# EAGLE schematic Main_Board (EAGLE 9.2.1)

## Sheet 1 of 9: Sync generation circuit
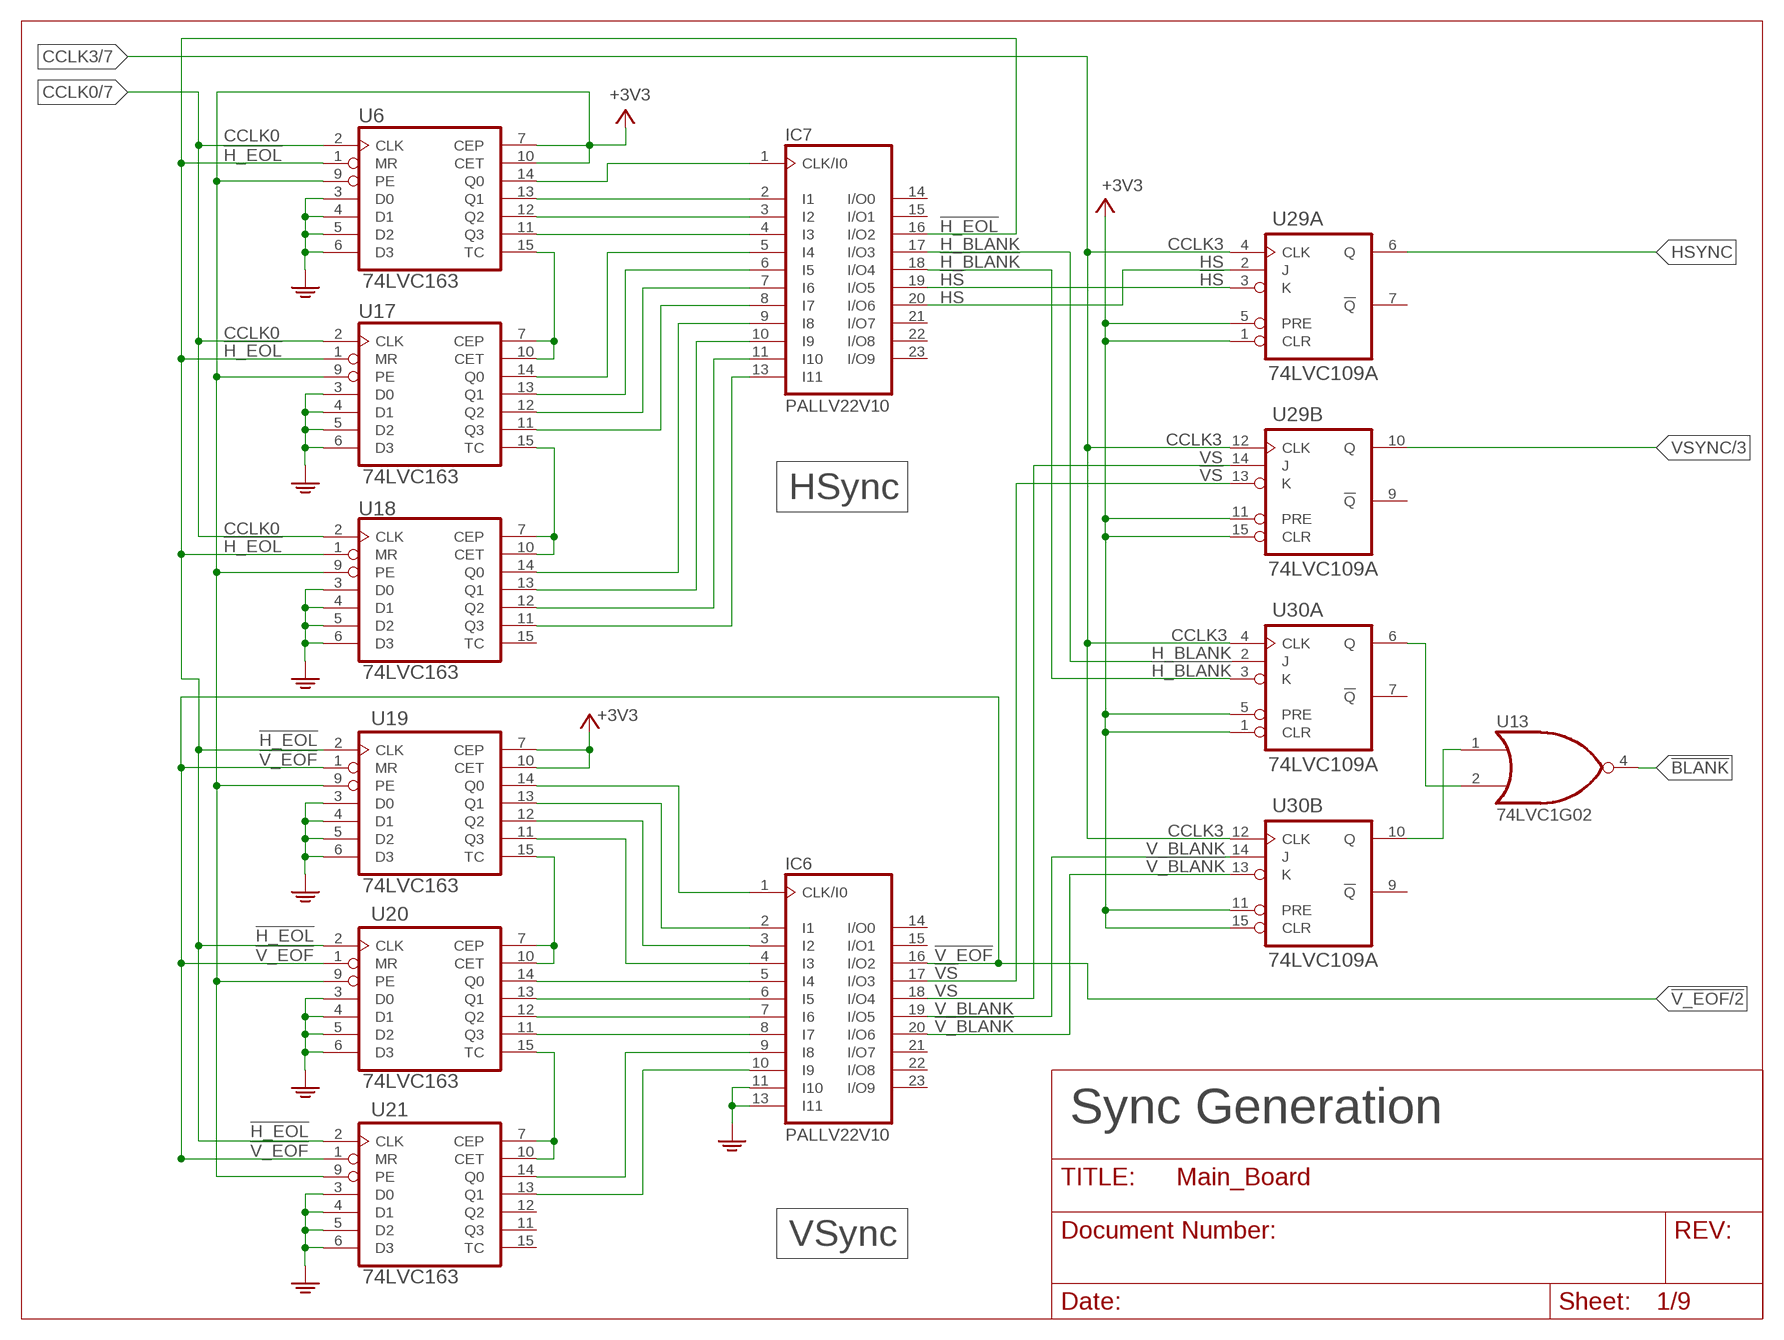
[diagram p0: schematic, sheet 1]

### Parts
IC6  PALLV22V10  [DIP24]
IC7  PALLV22V10  [DIP24]
U6  74LVC163  [SO16D(SOT109)]
U13  74LVC1G02  [SC70-5(SOT353)]
U17  74LVC163  [SO16D(SOT109)]
U18  74LVC163  [SO16D(SOT109)]
U19  74LVC163  [SO16D(SOT109)]
U20  74LVC163  [SO16D(SOT109)]
U21  74LVC163  [SO16D(SOT109)]
U29  74LVC109A  [SO16D(SOT109)]
U30  74LVC109A  [SO16D(SOT109)]

### Nets
!BLANK: U13.4(Y) ; also sheet 6
!H_BLANK: IC7.18(I/O4) U30.3(A:K)
!H_EOL: IC7.16(I/O2) U6.1(MR) U17.1(MR) U18.1(MR) U19.2(CLK) U20.2(CLK) U21.2(CLK)
!HS: IC7.19(I/O5) U29.3(A:K)
!V_BLANK: IC6.20(I/O6) U30.13(B:K)
!V_EOF: IC6.16(I/O2) U19.1(MR) U20.1(MR) U21.1(MR) ; also sheet 2
!VS: IC6.17(I/O3) U29.13(B:K)
+3V3: U6.7(CEP) U6.9(PE) U6.10(CET) U17.9(PE) U18.9(PE) U19.7(CEP) U19.9(PE) U19.10(CET) U20.9(PE) U21.9(PE) U29.1(A:CLR) U29.5(A:PRE) U29.11(B:PRE) U29.15(B:CLR) U30.1(A:CLR) U30.5(A:PRE) U30.11(B:PRE) U30.15(B:CLR) ; also sheet 2,3,4,5,7,8,9
CCLK0: U6.2(CLK) U17.2(CLK) U18.2(CLK) ; also sheet 7
CCLK3: U29.4(A:CLK) U29.12(B:CLK) U30.4(A:CLK) U30.12(B:CLK) ; also sheet 7
GND: IC6.11(I10) IC6.13(I11) U6.3(D0) U6.4(D1) U6.5(D2) U6.6(D3) U17.3(D0) U17.4(D1) U17.5(D2) U17.6(D3) U18.3(D0) U18.4(D1) U18.5(D2) U18.6(D3) U19.3(D0) U19.4(D1) U19.5(D2) U19.6(D3) U20.3(D0) U20.4(D1) U20.5(D2) U20.6(D3) U21.3(D0) U21.4(D1) U21.5(D2) U21.6(D3) ; also sheet 2,3,4,5,6,7,8
H_BLANK: IC7.17(I/O3) U30.2(A:J)
H_Q0: IC7.1(CLK/I0) U6.14(Q0)
H_Q1: IC7.2(I1) U6.13(Q1)
H_Q2: IC7.3(I2) U6.12(Q2)
H_Q3: IC7.4(I3) U6.11(Q3)
H_Q4: IC7.5(I4) U17.14(Q0)
H_Q5: IC7.6(I5) U17.13(Q1)
H_Q6: IC7.7(I6) U17.12(Q2)
H_Q7: IC7.8(I7) U17.11(Q3)
H_Q8: IC7.9(I8) U18.14(Q0)
H_Q9: IC7.10(I9) U18.13(Q1)
H_Q10: IC7.11(I10) U18.12(Q2)
H_Q11: IC7.13(I11) U18.11(Q3)
HB_L: U13.2(B) U30.6(A:Q)
HS: IC7.20(I/O6) U29.2(A:J)
HSYNC: U29.6(A:Q) ; also sheet 6
N$26: U6.15(TC) U17.7(CEP) U17.10(CET)
N$27: U17.15(TC) U18.7(CEP) U18.10(CET)
N$44: U19.15(TC) U20.7(CEP) U20.10(CET)
N$45: U20.15(TC) U21.7(CEP) U21.10(CET)
V_BLANK: IC6.19(I/O5) U30.14(B:J)
V_Q0: IC6.1(CLK/I0) U19.14(Q0)
V_Q1: IC6.2(I1) U19.13(Q1)
V_Q2: IC6.3(I2) U19.12(Q2)
V_Q3: IC6.4(I3) U19.11(Q3)
V_Q4: IC6.5(I4) U20.14(Q0)
V_Q5: IC6.6(I5) U20.13(Q1)
V_Q6: IC6.7(I6) U20.12(Q2)
V_Q7: IC6.8(I7) U20.11(Q3)
V_Q8: IC6.9(I8) U21.14(Q0)
V_Q9: IC6.10(I9) U21.13(Q1)
VB_L: U13.1(A) U30.10(B:Q)
VS: IC6.18(I/O4) U29.14(B:J)
VSYNC: U29.10(B:Q) ; also sheet 3,6
Unconnected: IC6.14(I/O0) IC6.15(I/O1) IC6.21(I/O7) IC6.22(I/O8) IC6.23(I/O9) IC7.14(I/O0) IC7.15(I/O1) IC7.21(I/O7) IC7.22(I/O8) IC7.23(I/O9) U18.15(TC) U21.11(Q3) U21.12(Q2) U21.15(TC) U29.7(A:!Q) U29.9(B:!Q) U30.7(A:!Q) U30.9(B:!Q)

### Notes on the sheet
- HSync
- Sync Generation
- VSync

## Sheet 2 of 9: Pixel address counter
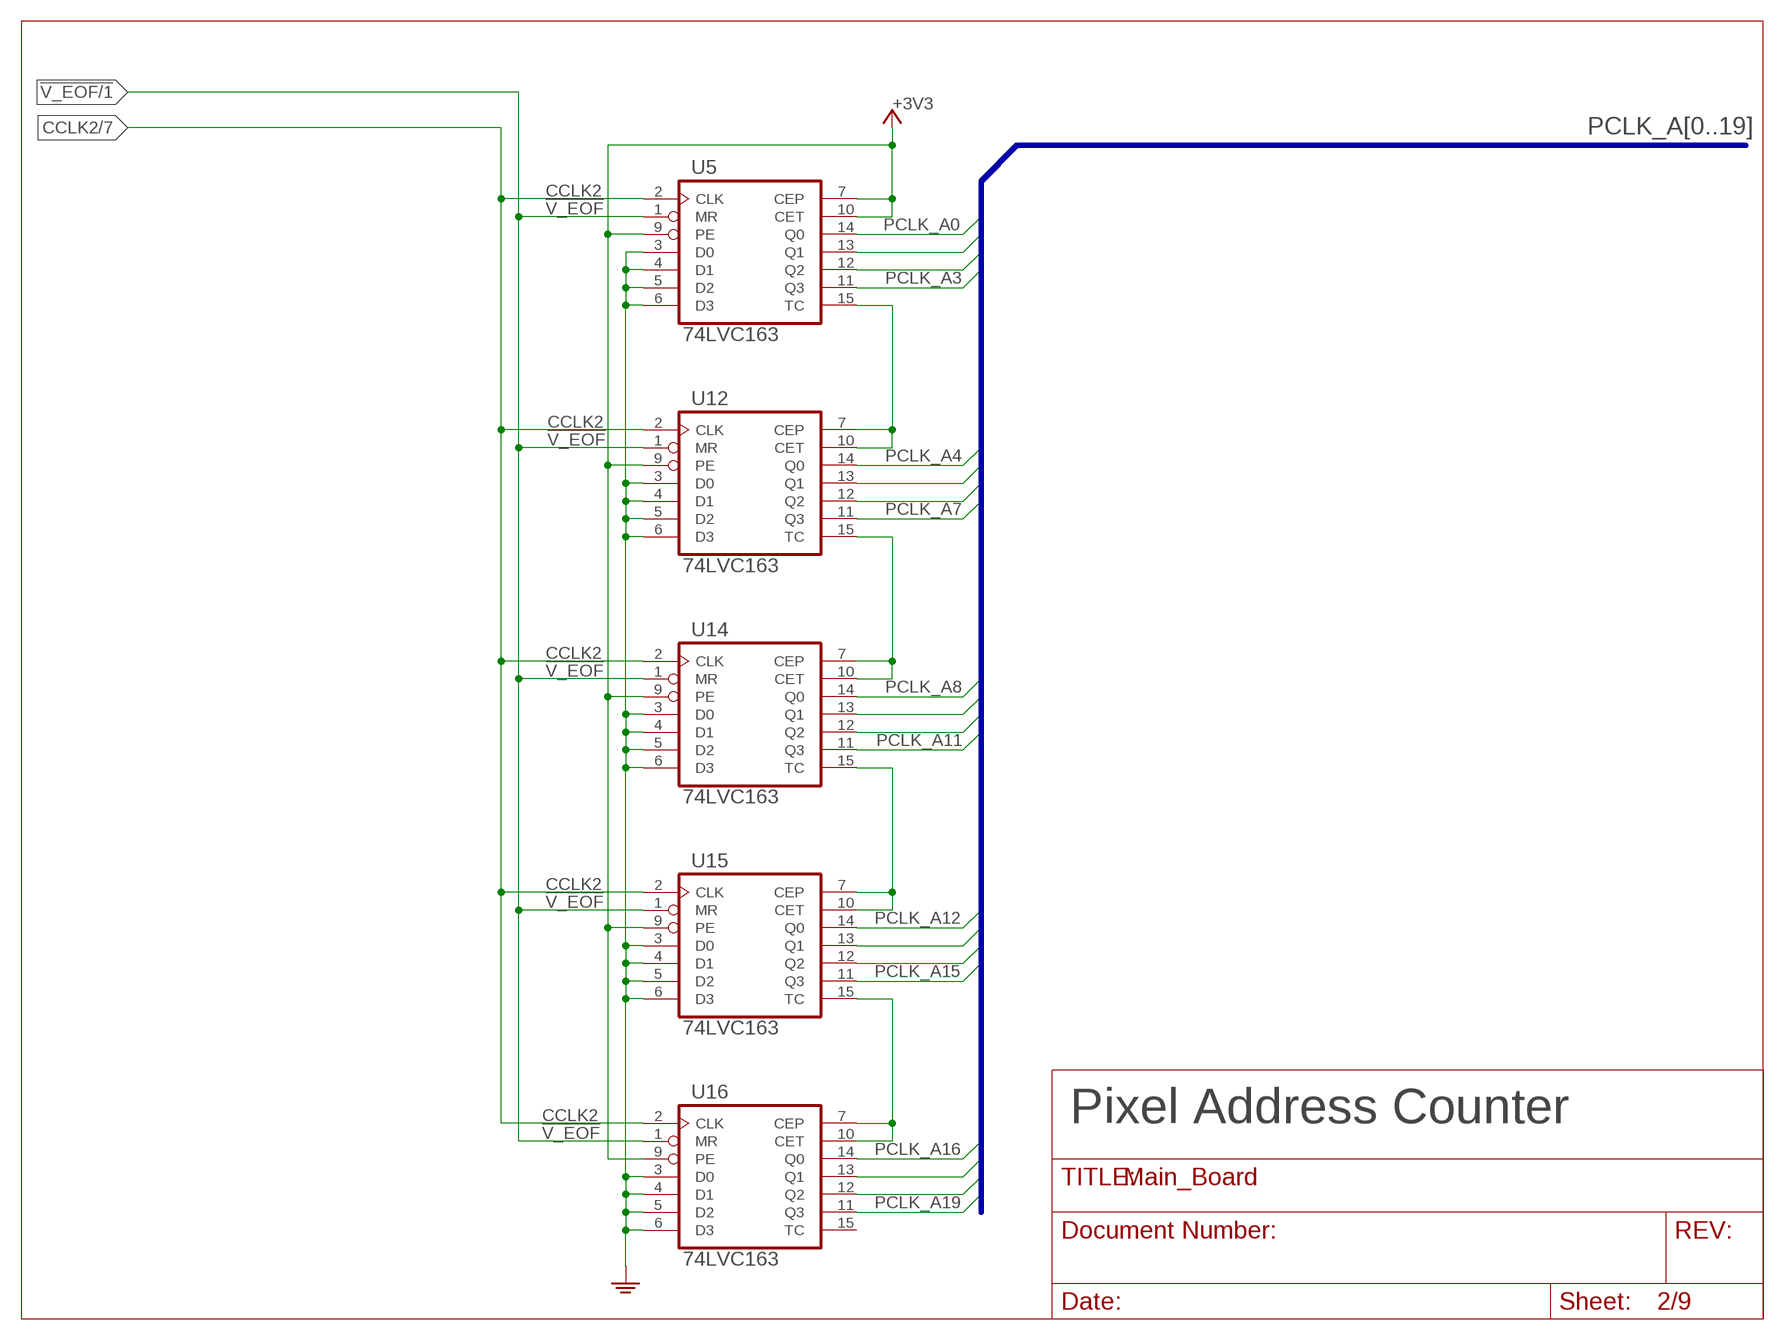
[diagram p1: schematic, sheet 2]

### Parts
U5  74LVC163  [SO16D(SOT109)]
U12  74LVC163  [SO16D(SOT109)]
U14  74LVC163  [SO16D(SOT109)]
U15  74LVC163  [SO16D(SOT109)]
U16  74LVC163  [SO16D(SOT109)]

### Nets
!V_EOF: U5.1(MR) U12.1(MR) U14.1(MR) U15.1(MR) U16.1(MR) ; also sheet 1
+3V3: U5.7(CEP) U5.9(PE) U5.10(CET) U12.9(PE) U14.9(PE) U15.9(PE) U16.9(PE) ; also sheet 1,3,4,5,7,8,9
CCLK2: U5.2(CLK) U12.2(CLK) U14.2(CLK) U15.2(CLK) U16.2(CLK) ; also sheet 7
GND: U5.3(D0) U5.4(D1) U5.5(D2) U5.6(D3) U12.3(D0) U12.4(D1) U12.5(D2) U12.6(D3) U14.3(D0) U14.4(D1) U14.5(D2) U14.6(D3) U15.3(D0) U15.4(D1) U15.5(D2) U15.6(D3) U16.3(D0) U16.4(D1) U16.5(D2) U16.6(D3) ; also sheet 1,3,4,5,6,7,8
N$1: U15.15(TC) U16.7(CEP) U16.10(CET)
N$15: U5.15(TC) U12.7(CEP) U12.10(CET)
N$16: U12.15(TC) U14.7(CEP) U14.10(CET)
N$18: U14.15(TC) U15.7(CEP) U15.10(CET)
PCLK_A0: U5.14(Q0) ; also sheet 4,5
PCLK_A1: U5.13(Q1) ; also sheet 4,5
PCLK_A2: U5.12(Q2) ; also sheet 4,5
PCLK_A3: U5.11(Q3) ; also sheet 4,5
PCLK_A4: U12.14(Q0) ; also sheet 4,5
PCLK_A5: U12.13(Q1) ; also sheet 4,5
PCLK_A6: U12.12(Q2) ; also sheet 4,5
PCLK_A7: U12.11(Q3) ; also sheet 4,5
PCLK_A8: U14.14(Q0) ; also sheet 4,5
PCLK_A9: U14.13(Q1) ; also sheet 4,5
PCLK_A10: U14.12(Q2) ; also sheet 4,5
PCLK_A11: U14.11(Q3) ; also sheet 4,5
PCLK_A12: U15.14(Q0) ; also sheet 4,5
PCLK_A13: U15.13(Q1) ; also sheet 4,5
PCLK_A14: U15.12(Q2) ; also sheet 4,5
PCLK_A15: U15.11(Q3) ; also sheet 4,5
PCLK_A16: U16.14(Q0) ; also sheet 4,5
PCLK_A17: U16.13(Q1) ; also sheet 4,5
PCLK_A18: U16.12(Q2) ; also sheet 4,5
PCLK_A19: U16.11(Q3) ; also sheet 4,5
Unconnected: U16.15(TC)

### Buses
PCLK_A[0..19]

### Notes on the sheet
- Pixel Address Counter

## Sheet 3 of 9: SPI decoder & latching circuit
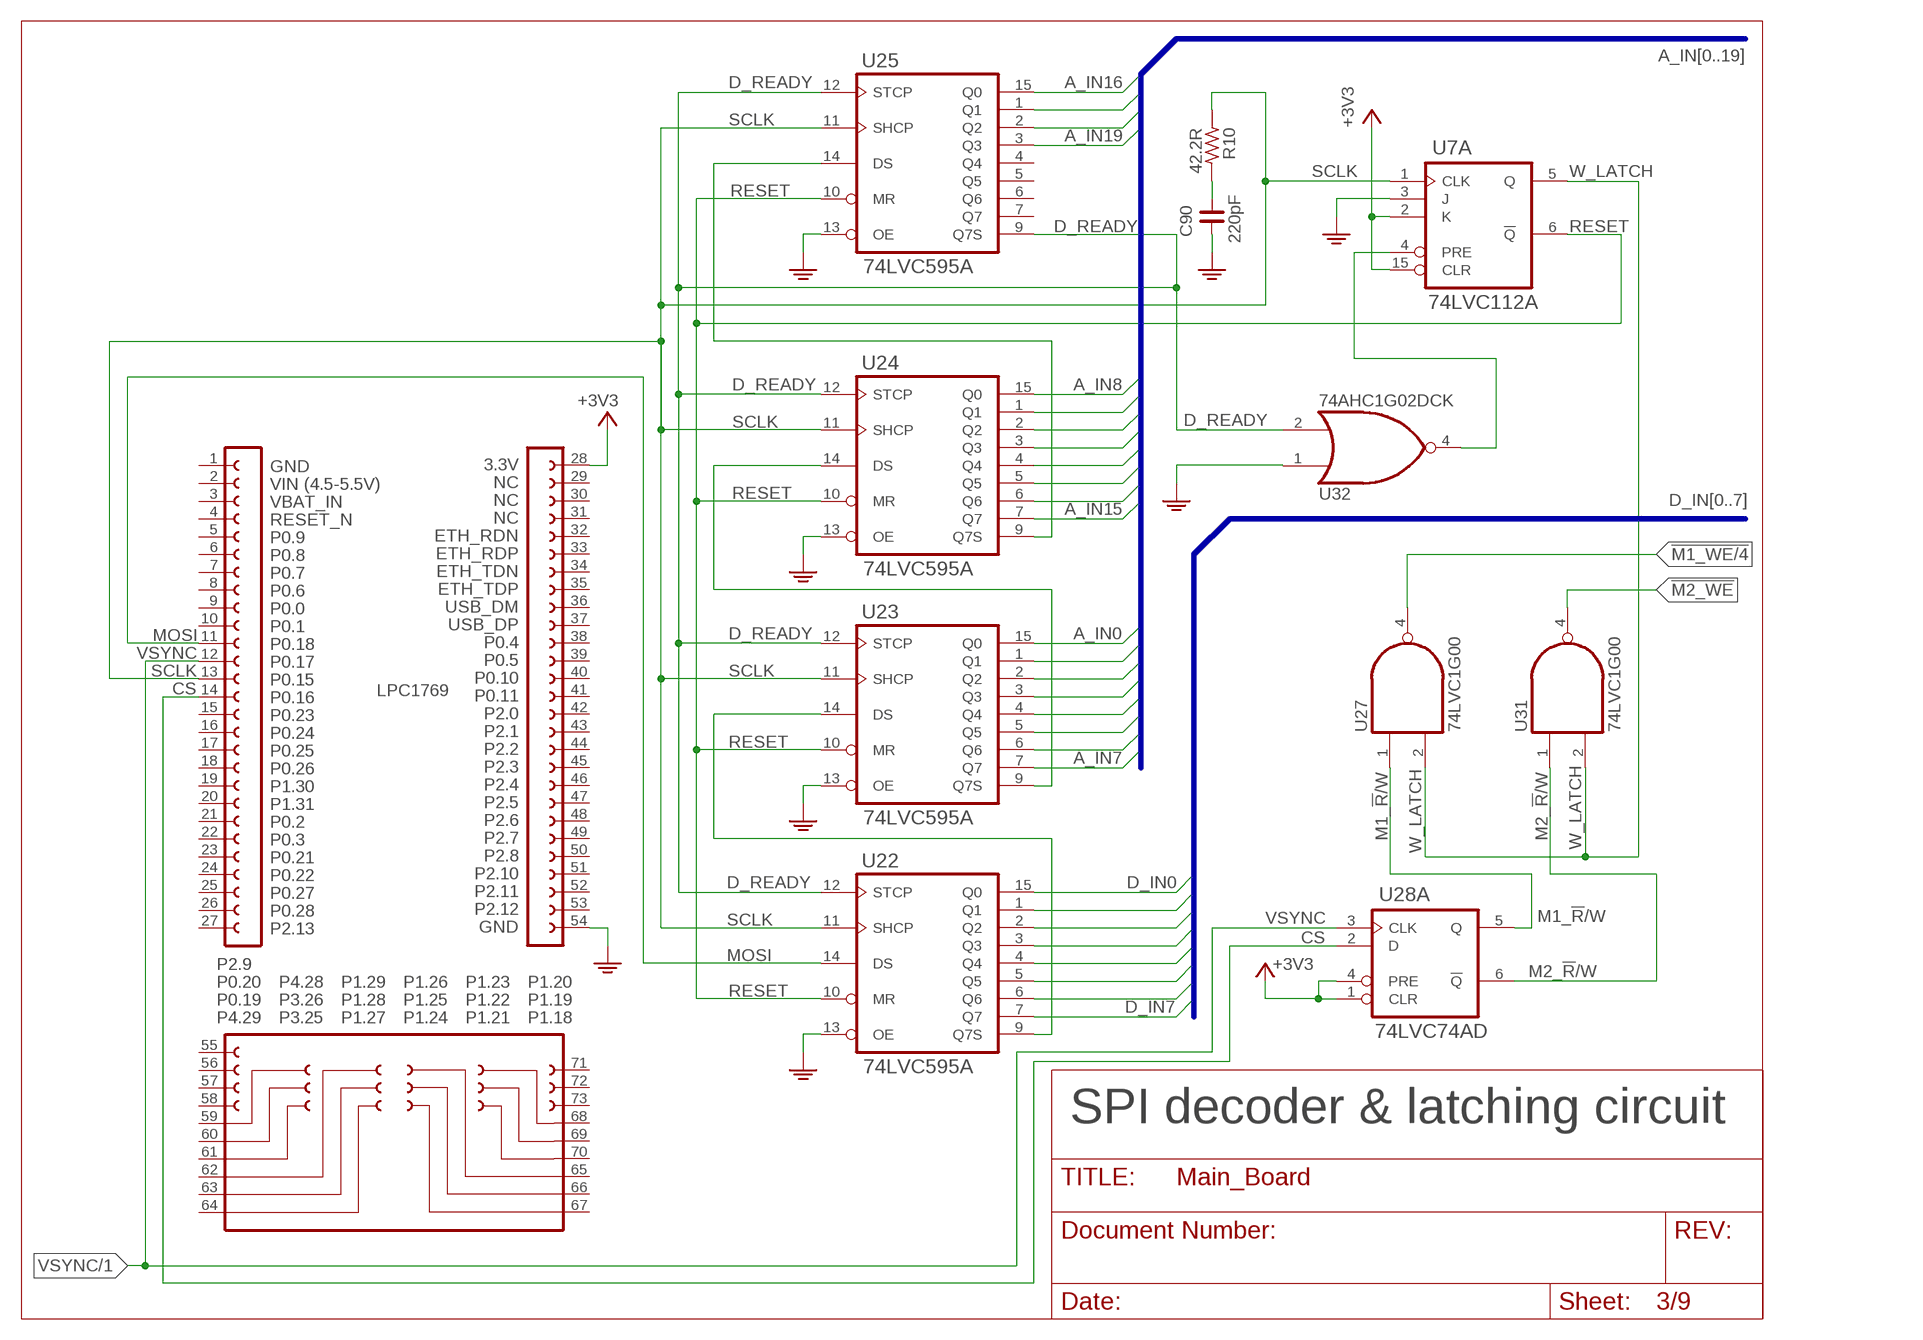
[diagram p2: schematic, sheet 3]

### Parts
C90  220pF  C_0603  [C0603]
LPC1769  LPCXPRESSO_LPC1769  [LPCXPRESSO_LPC1769]
R10  42.2R  R_0603  [R0603]
U7  74LVC112A  [SO16D(SOT109)]
U22  74LVC595A  [SO16D(SOT109)]
U23  74LVC595A  [SO16D(SOT109)]
U24  74LVC595A  [SO16D(SOT109)]
U25  74LVC595A  [SO16D(SOT109)]
U27  74LVC1G00  [SC70-5(SOT353)]
U28  74LVC74AD  [SO14(SOT108)]
U31  74LVC1G00  [SC70-5(SOT353)]
U32  74AHC1G02DCK  74AHC1G02DCKSC70-5  [SC70-5(SOT353)]

### Nets
!M1_WE: U27.4(Y) ; also sheet 4
!M2_WE: U31.4(Y) ; also sheet 5
+3V3: LPC1769.28 U7.2(A:K) U7.15(A:CLR) U28.1(A:CLR) U28.4(A:PRE) ; also sheet 1,2,4,5,7,8,9
A_IN0: U23.15(Q0) ; also sheet 4,5
A_IN1: U23.1(Q1) ; also sheet 4,5
A_IN2: U23.2(Q2) ; also sheet 4,5
A_IN3: U23.3(Q3) ; also sheet 4,5
A_IN4: U23.4(Q4) ; also sheet 4,5
A_IN5: U23.5(Q5) ; also sheet 4,5
A_IN6: U23.6(Q6) ; also sheet 4,5
A_IN7: U23.7(Q7) ; also sheet 4,5
A_IN8: U24.15(Q0) ; also sheet 4,5
A_IN9: U24.1(Q1) ; also sheet 4,5
A_IN10: U24.2(Q2) ; also sheet 4,5
A_IN11: U24.3(Q3) ; also sheet 4,5
A_IN12: U24.4(Q4) ; also sheet 4,5
A_IN13: U24.5(Q5) ; also sheet 4,5
A_IN14: U24.6(Q6) ; also sheet 4,5
A_IN15: U24.7(Q7) ; also sheet 4,5
A_IN16: U25.15(Q0) ; also sheet 4,5
A_IN17: U25.1(Q1) ; also sheet 4,5
A_IN18: U25.2(Q2) ; also sheet 4,5
A_IN19: U25.3(Q3) ; also sheet 4,5
CS: LPC1769.14 U28.2(A:D)
D_IN0: U22.15(Q0) ; also sheet 4,5
D_IN1: U22.1(Q1) ; also sheet 4,5
D_IN2: U22.2(Q2) ; also sheet 4,5
D_IN3: U22.3(Q3) ; also sheet 4,5
D_IN4: U22.4(Q4) ; also sheet 4,5
D_IN5: U22.5(Q5) ; also sheet 4,5
D_IN6: U22.6(Q6) ; also sheet 4,5
D_IN7: U22.7(Q7) ; also sheet 4,5
D_READY: U22.12(STCP) U23.12(STCP) U24.12(STCP) U25.9(Q7S) U25.12(STCP) U32.2(B)
GND: C90.1 LPC1769.54 U7.3(A:J) U22.13(OE) U23.13(OE) U24.13(OE) U25.13(OE) U32.1(A) ; also sheet 1,2,4,5,6,7,8
M1_!R!/W: U27.1(B) U28.5(A:Q) ; also sheet 4,5
M2_!R!/W: U28.6(A:!Q) U31.1(B) ; also sheet 4,5
MOSI: LPC1769.11 U22.14(DS)
N$9: U22.9(Q7S) U23.14(DS)
N$10: U7.4(A:PRE) U32.4(Y)
N$13: U23.9(Q7S) U24.14(DS)
N$14: U24.9(Q7S) U25.14(DS)
N$23: C90.2 R10.2
RESET: U7.6(A:!Q) U22.10(MR) U23.10(MR) U24.10(MR) U25.10(MR)
SCLK: LPC1769.13 R10.1 U7.1(A:CLK) U22.11(SHCP) U23.11(SHCP) U24.11(SHCP) U25.11(SHCP)
VSYNC: LPC1769.12 U28.3(A:CLK) ; also sheet 1,6
W_LATCH: U7.5(A:Q) U27.2(A) U31.2(A)
Unconnected: LPC1769.1 LPC1769.2 LPC1769.3 LPC1769.4 LPC1769.5 LPC1769.6 LPC1769.7 LPC1769.8 LPC1769.9 LPC1769.10 LPC1769.15 LPC1769.16 LPC1769.17 LPC1769.18 LPC1769.19 LPC1769.20 LPC1769.21 LPC1769.22 LPC1769.23 LPC1769.24 LPC1769.25 LPC1769.26 LPC1769.27 LPC1769.29 LPC1769.30 LPC1769.31 LPC1769.32 LPC1769.33 LPC1769.34 LPC1769.35 LPC1769.36 LPC1769.37 LPC1769.38 LPC1769.39 LPC1769.40 LPC1769.41 LPC1769.42 LPC1769.43 LPC1769.44 LPC1769.45 LPC1769.46 LPC1769.47 LPC1769.48 LPC1769.49 LPC1769.50 LPC1769.51 LPC1769.52 LPC1769.53 LPC1769.55 LPC1769.56 LPC1769.57 LPC1769.58 LPC1769.59 LPC1769.60 LPC1769.61 LPC1769.62 LPC1769.63 LPC1769.64 LPC1769.65 LPC1769.66 LPC1769.67 LPC1769.68 LPC1769.69 LPC1769.70 LPC1769.71 LPC1769.72 LPC1769.73 U25.4(Q4) U25.5(Q5) U25.6(Q6) U25.7(Q7)

### Buses
A_IN[0..19]
D_IN[0..7]

### Notes on the sheet
- SPI decoder & latching circuit

## Sheet 4 of 9: SRAM1 circuit
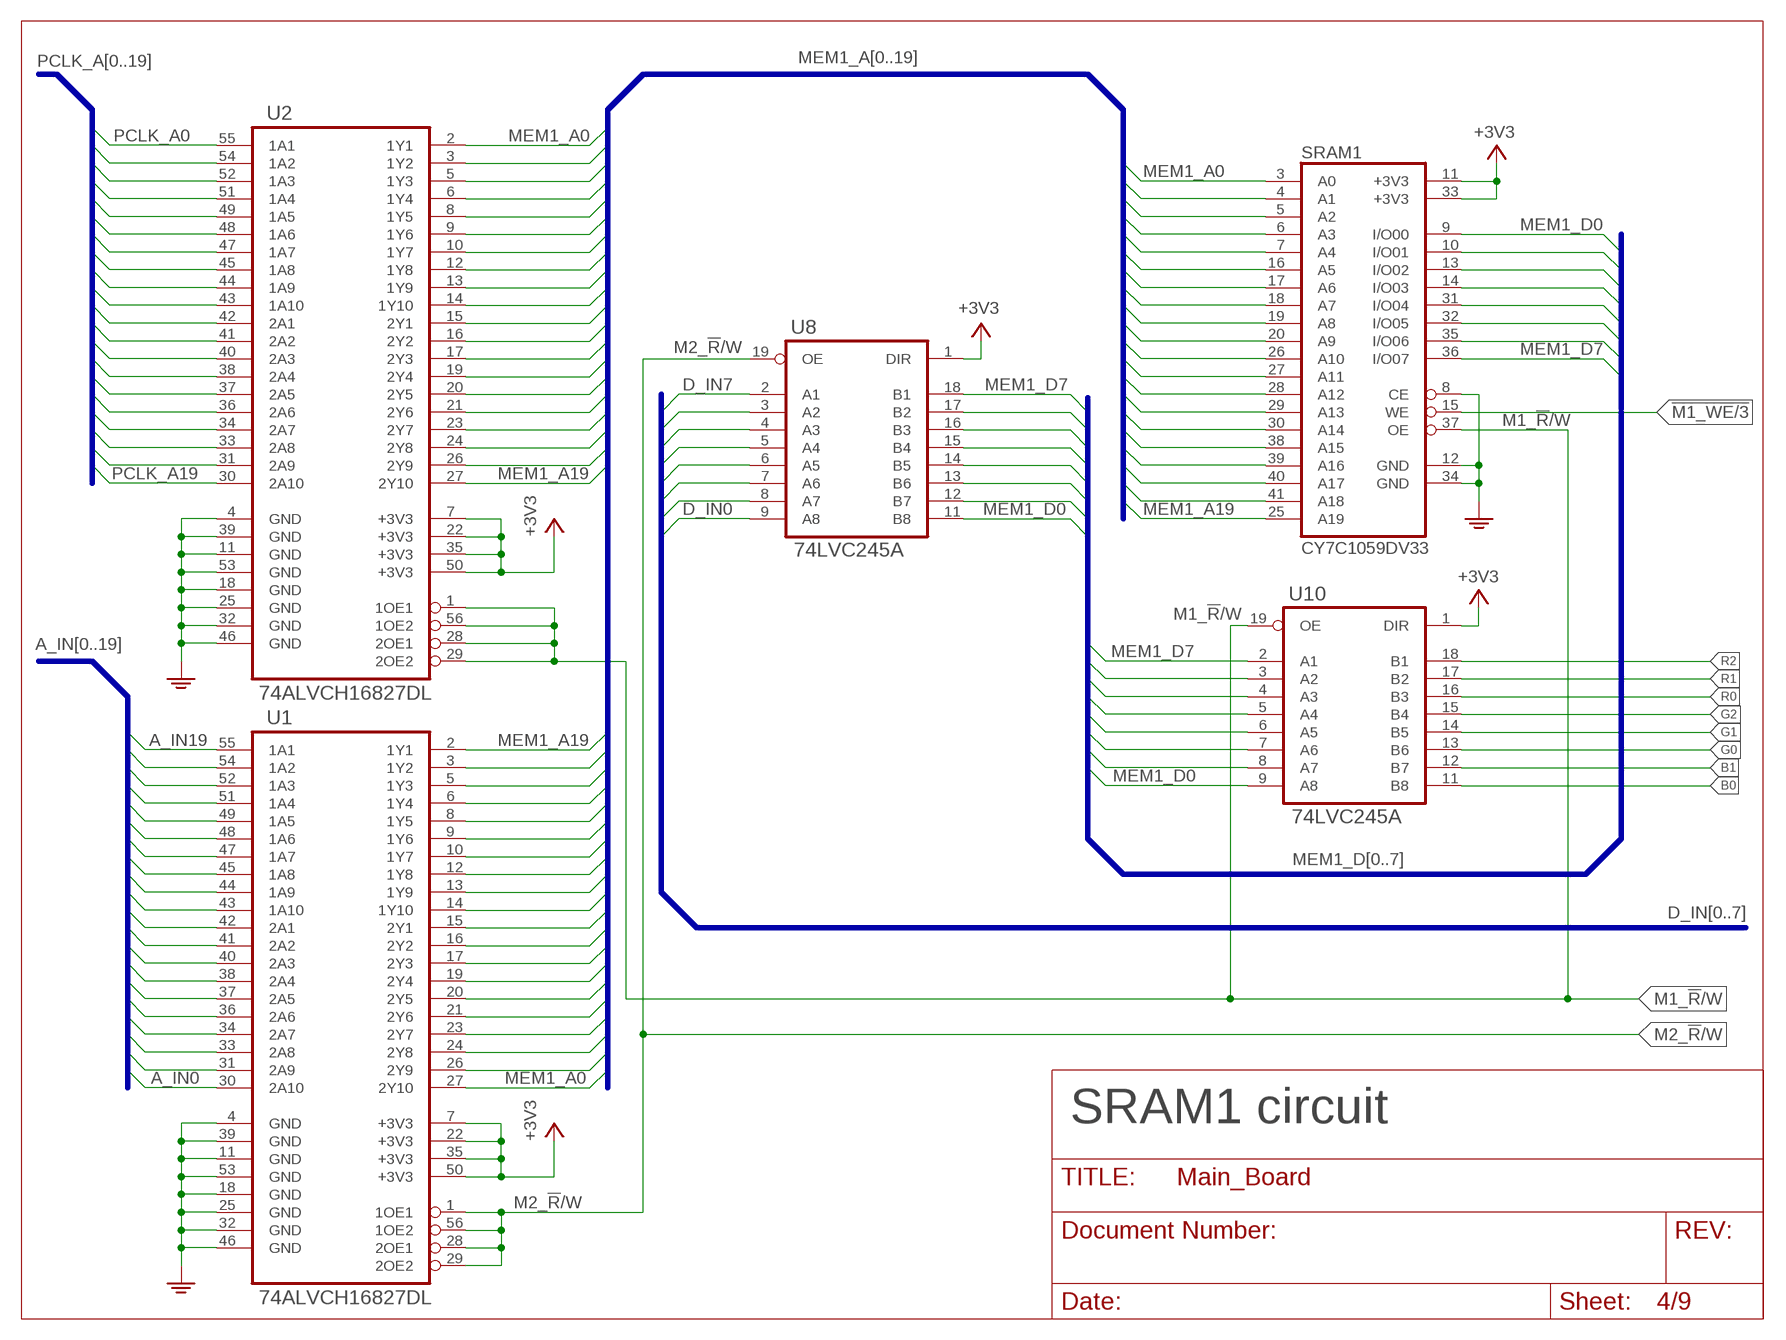
[diagram p3: schematic, sheet 4]

### Parts
SRAM1  CY7C1059DV33  [TSOPII-44]
U1  74ALVCH16827DL  [SSOP56(SOT371)]
U2  74ALVCH16827DL  [SSOP56(SOT371)]
U8  74LVC245A  [SO20DW(SOT163)]
U10  74LVC245A  [SO20DW(SOT163)]

### Nets
!M1_WE: SRAM1.15(WE) ; also sheet 3
+3V3: SRAM1.11(+3V3) SRAM1.33(+3V3) U1.7(+3V3) U1.22(+3V3) U1.35(+3V3) U1.50(+3V3) U2.7(+3V3) U2.22(+3V3) U2.35(+3V3) U2.50(+3V3) U8.1(DIR) U10.1(DIR) ; also sheet 1,2,3,5,7,8,9
A_IN0: U1.30(2A10) ; also sheet 3,5
A_IN1: U1.31(2A9) ; also sheet 3,5
A_IN2: U1.33(2A8) ; also sheet 3,5
A_IN3: U1.34(2A7) ; also sheet 3,5
A_IN4: U1.36(2A6) ; also sheet 3,5
A_IN5: U1.37(2A5) ; also sheet 3,5
A_IN6: U1.38(2A4) ; also sheet 3,5
A_IN7: U1.40(2A3) ; also sheet 3,5
A_IN8: U1.41(2A2) ; also sheet 3,5
A_IN9: U1.42(2A1) ; also sheet 3,5
A_IN10: U1.43(1A10) ; also sheet 3,5
A_IN11: U1.44(1A9) ; also sheet 3,5
A_IN12: U1.45(1A8) ; also sheet 3,5
A_IN13: U1.47(1A7) ; also sheet 3,5
A_IN14: U1.48(1A6) ; also sheet 3,5
A_IN15: U1.49(1A5) ; also sheet 3,5
A_IN16: U1.51(1A4) ; also sheet 3,5
A_IN17: U1.52(1A3) ; also sheet 3,5
A_IN18: U1.54(1A2) ; also sheet 3,5
A_IN19: U1.55(1A1) ; also sheet 3,5
B0: U10.11(B8) ; also sheet 5,6
B1: U10.12(B7) ; also sheet 5,6
D_IN0: U8.9(A8) ; also sheet 3,5
D_IN1: U8.8(A7) ; also sheet 3,5
D_IN2: U8.7(A6) ; also sheet 3,5
D_IN3: U8.6(A5) ; also sheet 3,5
D_IN4: U8.5(A4) ; also sheet 3,5
D_IN5: U8.4(A3) ; also sheet 3,5
D_IN6: U8.3(A2) ; also sheet 3,5
D_IN7: U8.2(A1) ; also sheet 3,5
G0: U10.13(B6) ; also sheet 5,6
G1: U10.14(B5) ; also sheet 5,6
G2: U10.15(B4) ; also sheet 5,6
GND: SRAM1.8(CE) SRAM1.12(GND) SRAM1.34(GND) U1.4(GND) U1.11(GND) U1.18(GND) U1.25(GND) U1.32(GND) U1.39(GND) U1.46(GND) U1.53(GND) U2.4(GND) U2.11(GND) U2.18(GND) U2.25(GND) U2.32(GND) U2.39(GND) U2.46(GND) U2.53(GND) ; also sheet 1,2,3,5,6,7,8
M1_!R!/W: SRAM1.37(OE) U2.1(1OE1) U2.28(2OE1) U2.29(2OE2) U2.56(1OE2) U10.19(OE) ; also sheet 3,5
M2_!R!/W: U1.1(1OE1) U1.28(2OE1) U1.29(2OE2) U1.56(1OE2) U8.19(OE) ; also sheet 3,5
MEM1_A0: SRAM1.3(A0) U1.27(2Y10) U2.2(1Y1)
MEM1_A1: SRAM1.4(A1) U1.26(2Y9) U2.3(1Y2)
MEM1_A2: SRAM1.5(A2) U1.24(2Y8) U2.5(1Y3)
MEM1_A3: SRAM1.6(A3) U1.23(2Y7) U2.6(1Y4)
MEM1_A4: SRAM1.7(A4) U1.21(2Y6) U2.8(1Y5)
MEM1_A5: SRAM1.16(A5) U1.20(2Y5) U2.9(1Y6)
MEM1_A6: SRAM1.17(A6) U1.19(2Y4) U2.10(1Y7)
MEM1_A7: SRAM1.18(A7) U1.17(2Y3) U2.12(1Y8)
MEM1_A8: SRAM1.19(A8) U1.16(2Y2) U2.13(1Y9)
MEM1_A9: SRAM1.20(A9) U1.15(2Y1) U2.14(1Y10)
MEM1_A10: SRAM1.26(A10) U1.14(1Y10) U2.15(2Y1)
MEM1_A11: SRAM1.27(A11) U1.13(1Y9) U2.16(2Y2)
MEM1_A12: SRAM1.28(A12) U1.12(1Y8) U2.17(2Y3)
MEM1_A13: SRAM1.29(A13) U1.10(1Y7) U2.19(2Y4)
MEM1_A14: SRAM1.30(A14) U1.9(1Y6) U2.20(2Y5)
MEM1_A15: SRAM1.38(A15) U1.8(1Y5) U2.21(2Y6)
MEM1_A16: SRAM1.39(A16) U1.6(1Y4) U2.23(2Y7)
MEM1_A17: SRAM1.40(A17) U1.5(1Y3) U2.24(2Y8)
MEM1_A18: SRAM1.41(A18) U1.3(1Y2) U2.26(2Y9)
MEM1_A19: SRAM1.25(A19) U1.2(1Y1) U2.27(2Y10)
MEM1_D0: SRAM1.9(I/O00) U8.11(B8) U10.9(A8)
MEM1_D1: SRAM1.10(I/O01) U8.12(B7) U10.8(A7)
MEM1_D2: SRAM1.13(I/O02) U8.13(B6) U10.7(A6)
MEM1_D3: SRAM1.14(I/O03) U8.14(B5) U10.6(A5)
MEM1_D4: SRAM1.31(I/O04) U8.15(B4) U10.5(A4)
MEM1_D5: SRAM1.32(I/O05) U8.16(B3) U10.4(A3)
MEM1_D6: SRAM1.35(I/O06) U8.17(B2) U10.3(A2)
MEM1_D7: SRAM1.36(I/O07) U8.18(B1) U10.2(A1)
PCLK_A0: U2.55(1A1) ; also sheet 2,5
PCLK_A1: U2.54(1A2) ; also sheet 2,5
PCLK_A2: U2.52(1A3) ; also sheet 2,5
PCLK_A3: U2.51(1A4) ; also sheet 2,5
PCLK_A4: U2.49(1A5) ; also sheet 2,5
PCLK_A5: U2.48(1A6) ; also sheet 2,5
PCLK_A6: U2.47(1A7) ; also sheet 2,5
PCLK_A7: U2.45(1A8) ; also sheet 2,5
PCLK_A8: U2.44(1A9) ; also sheet 2,5
PCLK_A9: U2.43(1A10) ; also sheet 2,5
PCLK_A10: U2.42(2A1) ; also sheet 2,5
PCLK_A11: U2.41(2A2) ; also sheet 2,5
PCLK_A12: U2.40(2A3) ; also sheet 2,5
PCLK_A13: U2.38(2A4) ; also sheet 2,5
PCLK_A14: U2.37(2A5) ; also sheet 2,5
PCLK_A15: U2.36(2A6) ; also sheet 2,5
PCLK_A16: U2.34(2A7) ; also sheet 2,5
PCLK_A17: U2.33(2A8) ; also sheet 2,5
PCLK_A18: U2.31(2A9) ; also sheet 2,5
PCLK_A19: U2.30(2A10) ; also sheet 2,5
R0: U10.16(B3) ; also sheet 5,6
R1: U10.17(B2) ; also sheet 5,6
R2: U10.18(B1) ; also sheet 5,6

### Buses
MEM1_A[0..19]
PCLK_A[0..19]
A_IN[0..19]
D_IN[0..7]
MEM1_D[0..7]

### Notes on the sheet
- SRAM1 circuit

## Sheet 5 of 9: SRAM2 circuit
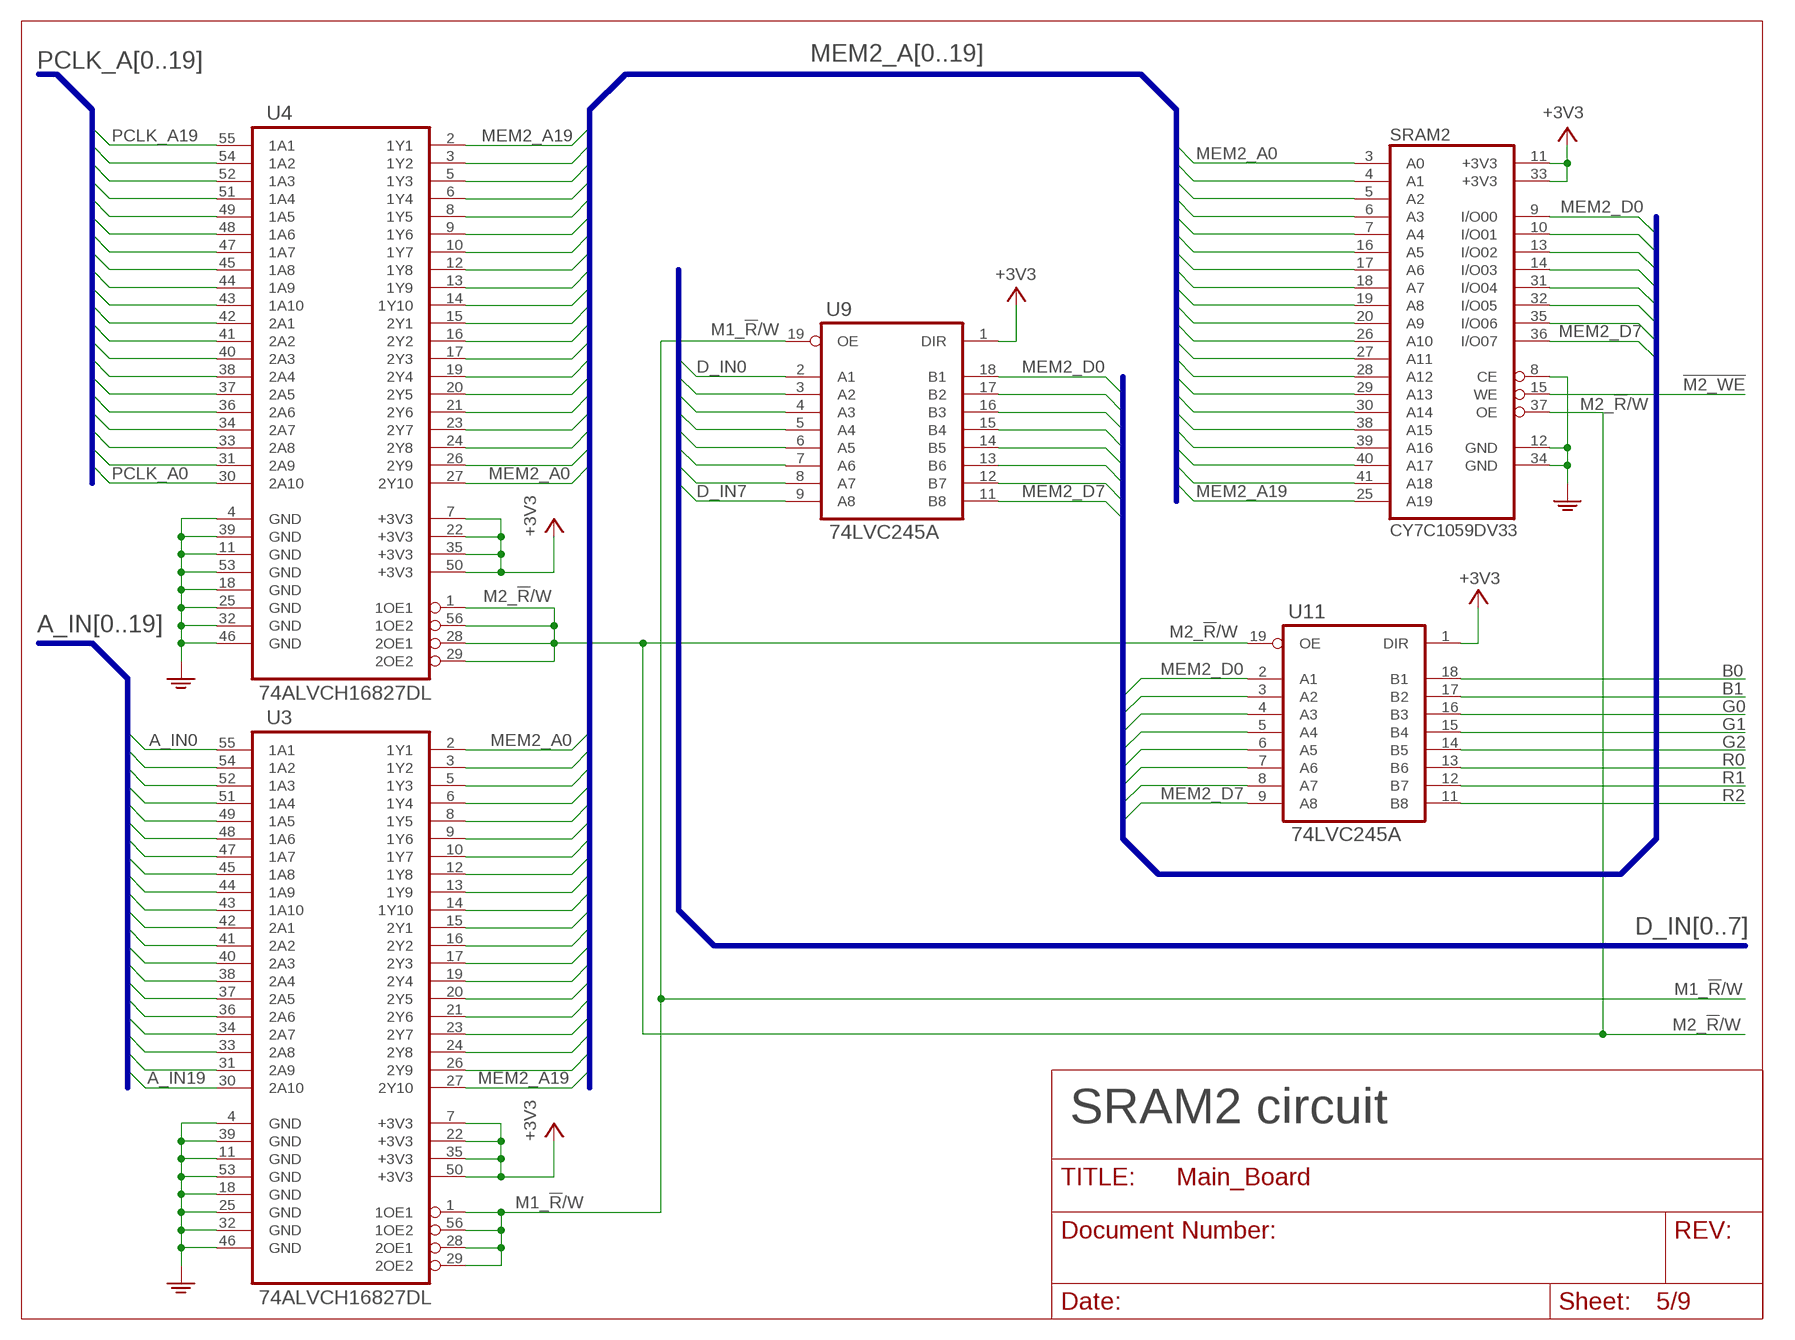
[diagram p4: schematic, sheet 5]

### Parts
SRAM2  CY7C1059DV33  [TSOPII-44]
U3  74ALVCH16827DL  [SSOP56(SOT371)]
U4  74ALVCH16827DL  [SSOP56(SOT371)]
U9  74LVC245A  [SO20DW(SOT163)]
U11  74LVC245A  [SO20DW(SOT163)]

### Nets
!M2_WE: SRAM2.15(WE) ; also sheet 3
+3V3: SRAM2.11(+3V3) SRAM2.33(+3V3) U3.7(+3V3) U3.22(+3V3) U3.35(+3V3) U3.50(+3V3) U4.7(+3V3) U4.22(+3V3) U4.35(+3V3) U4.50(+3V3) U9.1(DIR) U11.1(DIR) ; also sheet 1,2,3,4,7,8,9
A_IN0: U3.55(1A1) ; also sheet 3,4
A_IN1: U3.54(1A2) ; also sheet 3,4
A_IN2: U3.52(1A3) ; also sheet 3,4
A_IN3: U3.51(1A4) ; also sheet 3,4
A_IN4: U3.49(1A5) ; also sheet 3,4
A_IN5: U3.48(1A6) ; also sheet 3,4
A_IN6: U3.47(1A7) ; also sheet 3,4
A_IN7: U3.45(1A8) ; also sheet 3,4
A_IN8: U3.44(1A9) ; also sheet 3,4
A_IN9: U3.43(1A10) ; also sheet 3,4
A_IN10: U3.42(2A1) ; also sheet 3,4
A_IN11: U3.41(2A2) ; also sheet 3,4
A_IN12: U3.40(2A3) ; also sheet 3,4
A_IN13: U3.38(2A4) ; also sheet 3,4
A_IN14: U3.37(2A5) ; also sheet 3,4
A_IN15: U3.36(2A6) ; also sheet 3,4
A_IN16: U3.34(2A7) ; also sheet 3,4
A_IN17: U3.33(2A8) ; also sheet 3,4
A_IN18: U3.31(2A9) ; also sheet 3,4
A_IN19: U3.30(2A10) ; also sheet 3,4
B0: U11.18(B1) ; also sheet 4,6
B1: U11.17(B2) ; also sheet 4,6
D_IN0: U9.2(A1) ; also sheet 3,4
D_IN1: U9.3(A2) ; also sheet 3,4
D_IN2: U9.4(A3) ; also sheet 3,4
D_IN3: U9.5(A4) ; also sheet 3,4
D_IN4: U9.6(A5) ; also sheet 3,4
D_IN5: U9.7(A6) ; also sheet 3,4
D_IN6: U9.8(A7) ; also sheet 3,4
D_IN7: U9.9(A8) ; also sheet 3,4
G0: U11.16(B3) ; also sheet 4,6
G1: U11.15(B4) ; also sheet 4,6
G2: U11.14(B5) ; also sheet 4,6
GND: SRAM2.8(CE) SRAM2.12(GND) SRAM2.34(GND) U3.4(GND) U3.11(GND) U3.18(GND) U3.25(GND) U3.32(GND) U3.39(GND) U3.46(GND) U3.53(GND) U4.4(GND) U4.11(GND) U4.18(GND) U4.25(GND) U4.32(GND) U4.39(GND) U4.46(GND) U4.53(GND) ; also sheet 1,2,3,4,6,7,8
M1_!R!/W: U3.1(1OE1) U3.28(2OE1) U3.29(2OE2) U3.56(1OE2) U9.19(OE) ; also sheet 3,4
M2_!R!/W: SRAM2.37(OE) U4.1(1OE1) U4.28(2OE1) U4.29(2OE2) U4.56(1OE2) U11.19(OE) ; also sheet 3,4
MEM2_A0: SRAM2.3(A0) U3.2(1Y1) U4.27(2Y10)
MEM2_A1: SRAM2.4(A1) U3.3(1Y2) U4.26(2Y9)
MEM2_A2: SRAM2.5(A2) U3.5(1Y3) U4.24(2Y8)
MEM2_A3: SRAM2.6(A3) U3.6(1Y4) U4.23(2Y7)
MEM2_A4: SRAM2.7(A4) U3.8(1Y5) U4.21(2Y6)
MEM2_A5: SRAM2.16(A5) U3.9(1Y6) U4.20(2Y5)
MEM2_A6: SRAM2.17(A6) U3.10(1Y7) U4.19(2Y4)
MEM2_A7: SRAM2.18(A7) U3.12(1Y8) U4.17(2Y3)
MEM2_A8: SRAM2.19(A8) U3.13(1Y9) U4.16(2Y2)
MEM2_A9: SRAM2.20(A9) U3.14(1Y10) U4.15(2Y1)
MEM2_A10: SRAM2.26(A10) U3.15(2Y1) U4.14(1Y10)
MEM2_A11: SRAM2.27(A11) U3.16(2Y2) U4.13(1Y9)
MEM2_A12: SRAM2.28(A12) U3.17(2Y3) U4.12(1Y8)
MEM2_A13: SRAM2.29(A13) U3.19(2Y4) U4.10(1Y7)
MEM2_A14: SRAM2.30(A14) U3.20(2Y5) U4.9(1Y6)
MEM2_A15: SRAM2.38(A15) U3.21(2Y6) U4.8(1Y5)
MEM2_A16: SRAM2.39(A16) U3.23(2Y7) U4.6(1Y4)
MEM2_A17: SRAM2.40(A17) U3.24(2Y8) U4.5(1Y3)
MEM2_A18: SRAM2.41(A18) U3.26(2Y9) U4.3(1Y2)
MEM2_A19: SRAM2.25(A19) U3.27(2Y10) U4.2(1Y1)
MEM2_D0: SRAM2.9(I/O00) U9.18(B1) U11.2(A1)
MEM2_D1: SRAM2.10(I/O01) U9.17(B2) U11.3(A2)
MEM2_D2: SRAM2.13(I/O02) U9.16(B3) U11.4(A3)
MEM2_D3: SRAM2.14(I/O03) U9.15(B4) U11.5(A4)
MEM2_D4: SRAM2.31(I/O04) U9.14(B5) U11.6(A5)
MEM2_D5: SRAM2.32(I/O05) U9.13(B6) U11.7(A6)
MEM2_D6: SRAM2.35(I/O06) U9.12(B7) U11.8(A7)
MEM2_D7: SRAM2.36(I/O07) U9.11(B8) U11.9(A8)
PCLK_A0: U4.30(2A10) ; also sheet 2,4
PCLK_A1: U4.31(2A9) ; also sheet 2,4
PCLK_A2: U4.33(2A8) ; also sheet 2,4
PCLK_A3: U4.34(2A7) ; also sheet 2,4
PCLK_A4: U4.36(2A6) ; also sheet 2,4
PCLK_A5: U4.37(2A5) ; also sheet 2,4
PCLK_A6: U4.38(2A4) ; also sheet 2,4
PCLK_A7: U4.40(2A3) ; also sheet 2,4
PCLK_A8: U4.41(2A2) ; also sheet 2,4
PCLK_A9: U4.42(2A1) ; also sheet 2,4
PCLK_A10: U4.43(1A10) ; also sheet 2,4
PCLK_A11: U4.44(1A9) ; also sheet 2,4
PCLK_A12: U4.45(1A8) ; also sheet 2,4
PCLK_A13: U4.47(1A7) ; also sheet 2,4
PCLK_A14: U4.48(1A6) ; also sheet 2,4
PCLK_A15: U4.49(1A5) ; also sheet 2,4
PCLK_A16: U4.51(1A4) ; also sheet 2,4
PCLK_A17: U4.52(1A3) ; also sheet 2,4
PCLK_A18: U4.54(1A2) ; also sheet 2,4
PCLK_A19: U4.55(1A1) ; also sheet 2,4
R0: U11.13(B6) ; also sheet 4,6
R1: U11.12(B7) ; also sheet 4,6
R2: U11.11(B8) ; also sheet 4,6

### Buses
PCLK_A[0..19]
MEM2_A[0..19]
A_IN[0..19]
MEM2_D[0..7]
D_IN[0..7]

### Notes on the sheet
- SRAM2 circuit

## Sheet 6 of 9: Analog circuit
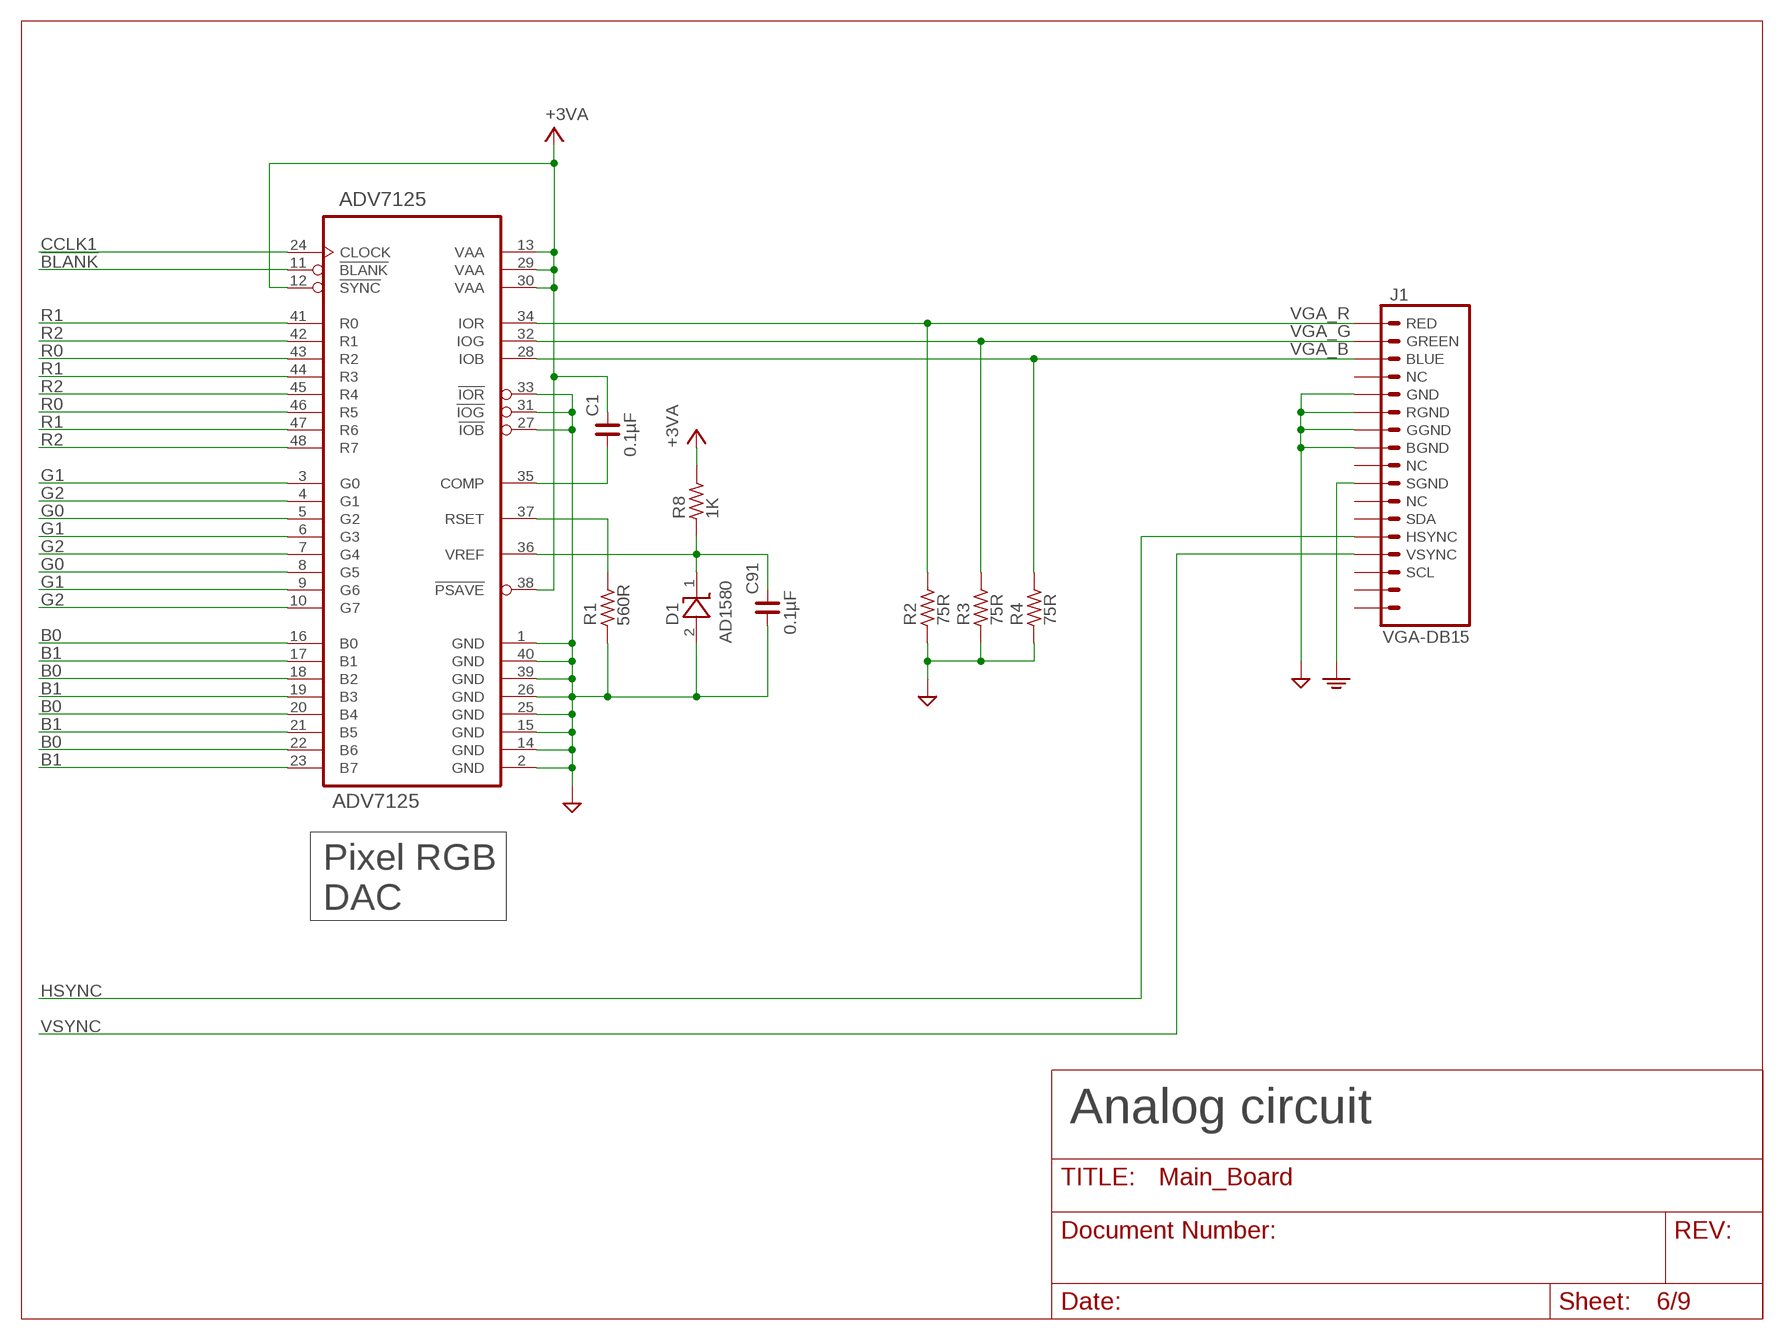
[diagram p5: schematic, sheet 6]

### Parts
ADV7125  ADV7125  [LQFP48(SOT313)]
C1  0.1µF  C_0603  [C0603]
C91  0.1µF  C_0603  [C0603]
D1  AD1580  [TO236-3(SOT23)]
J1  VGA-DB15  [DB15-VGA-90DEG]
R1  560R  R_0603  [R0603]
R2  75R  R_0603  [R0603]
R3  75R  R_0603  [R0603]
R4  75R  R_0603  [R0603]
R8  1K  R_0603  [R0603]

### Nets
!BLANK: ADV7125.11(!BLANK) ; also sheet 1
+3VA: ADV7125.12(!SYNC) ADV7125.13(VAA) ADV7125.29(VAA) ADV7125.30(VAA) ADV7125.38(!PSAVE) C1.2 R8.2 ; also sheet 8
AGND: ADV7125.1(GND) ADV7125.2(GND) ADV7125.14(GND) ADV7125.15(GND) ADV7125.25(GND) ADV7125.26(GND) ADV7125.27(!IOB) ADV7125.31(!IOG) ADV7125.33(!IOR) ADV7125.39(GND) ADV7125.40(GND) C91.1 D1.2(V-) J1.5(GND) J1.6(RGND) J1.7(GGND) J1.8(BGND) R1.1 R2.1 R3.1 R4.1 ; also sheet 8
B0: ADV7125.16(B0) ADV7125.18(B2) ADV7125.20(B4) ADV7125.22(B6) ; also sheet 4,5
B1: ADV7125.17(B1) ADV7125.19(B3) ADV7125.21(B5) ADV7125.23(B7) ; also sheet 4,5
CCLK1: ADV7125.24(CLOCK) ; also sheet 7
COMP: ADV7125.35(COMP) C1.1
G0: ADV7125.5(G2) ADV7125.8(G5) ; also sheet 4,5
G1: ADV7125.3(G0) ADV7125.6(G3) ADV7125.9(G6) ; also sheet 4,5
G2: ADV7125.4(G1) ADV7125.7(G4) ADV7125.10(G7) ; also sheet 4,5
GND: J1.10(SGND) ; also sheet 1,2,3,4,5,7,8
HSYNC: J1.13(HSYNC) ; also sheet 1
R0: ADV7125.43(R2) ADV7125.46(R5) ; also sheet 4,5
R1: ADV7125.41(R0) ADV7125.44(R3) ADV7125.47(R6) ; also sheet 4,5
R2: ADV7125.42(R1) ADV7125.45(R4) ADV7125.48(R7) ; also sheet 4,5
RSET: ADV7125.37(RSET) R1.2
VGA_B: ADV7125.28(IOB) J1.3(BLUE) R4.2
VGA_G: ADV7125.32(IOG) J1.2(GREEN) R3.2
VGA_R: ADV7125.34(IOR) J1.1(RED) R2.2
VREF: ADV7125.36(VREF) C91.2 D1.1(V+) R8.1
VSYNC: J1.14(VSYNC) ; also sheet 1,3
Unconnected: J1.4(NC) J1.9(NC) J1.11(NC) J1.12(SDA) J1.15(SCL) J1.P$1 J1.P$2

### Notes on the sheet
- Pixel RGB
  DAC
- Analog circuit

## Sheet 7 of 9: Clock circuit
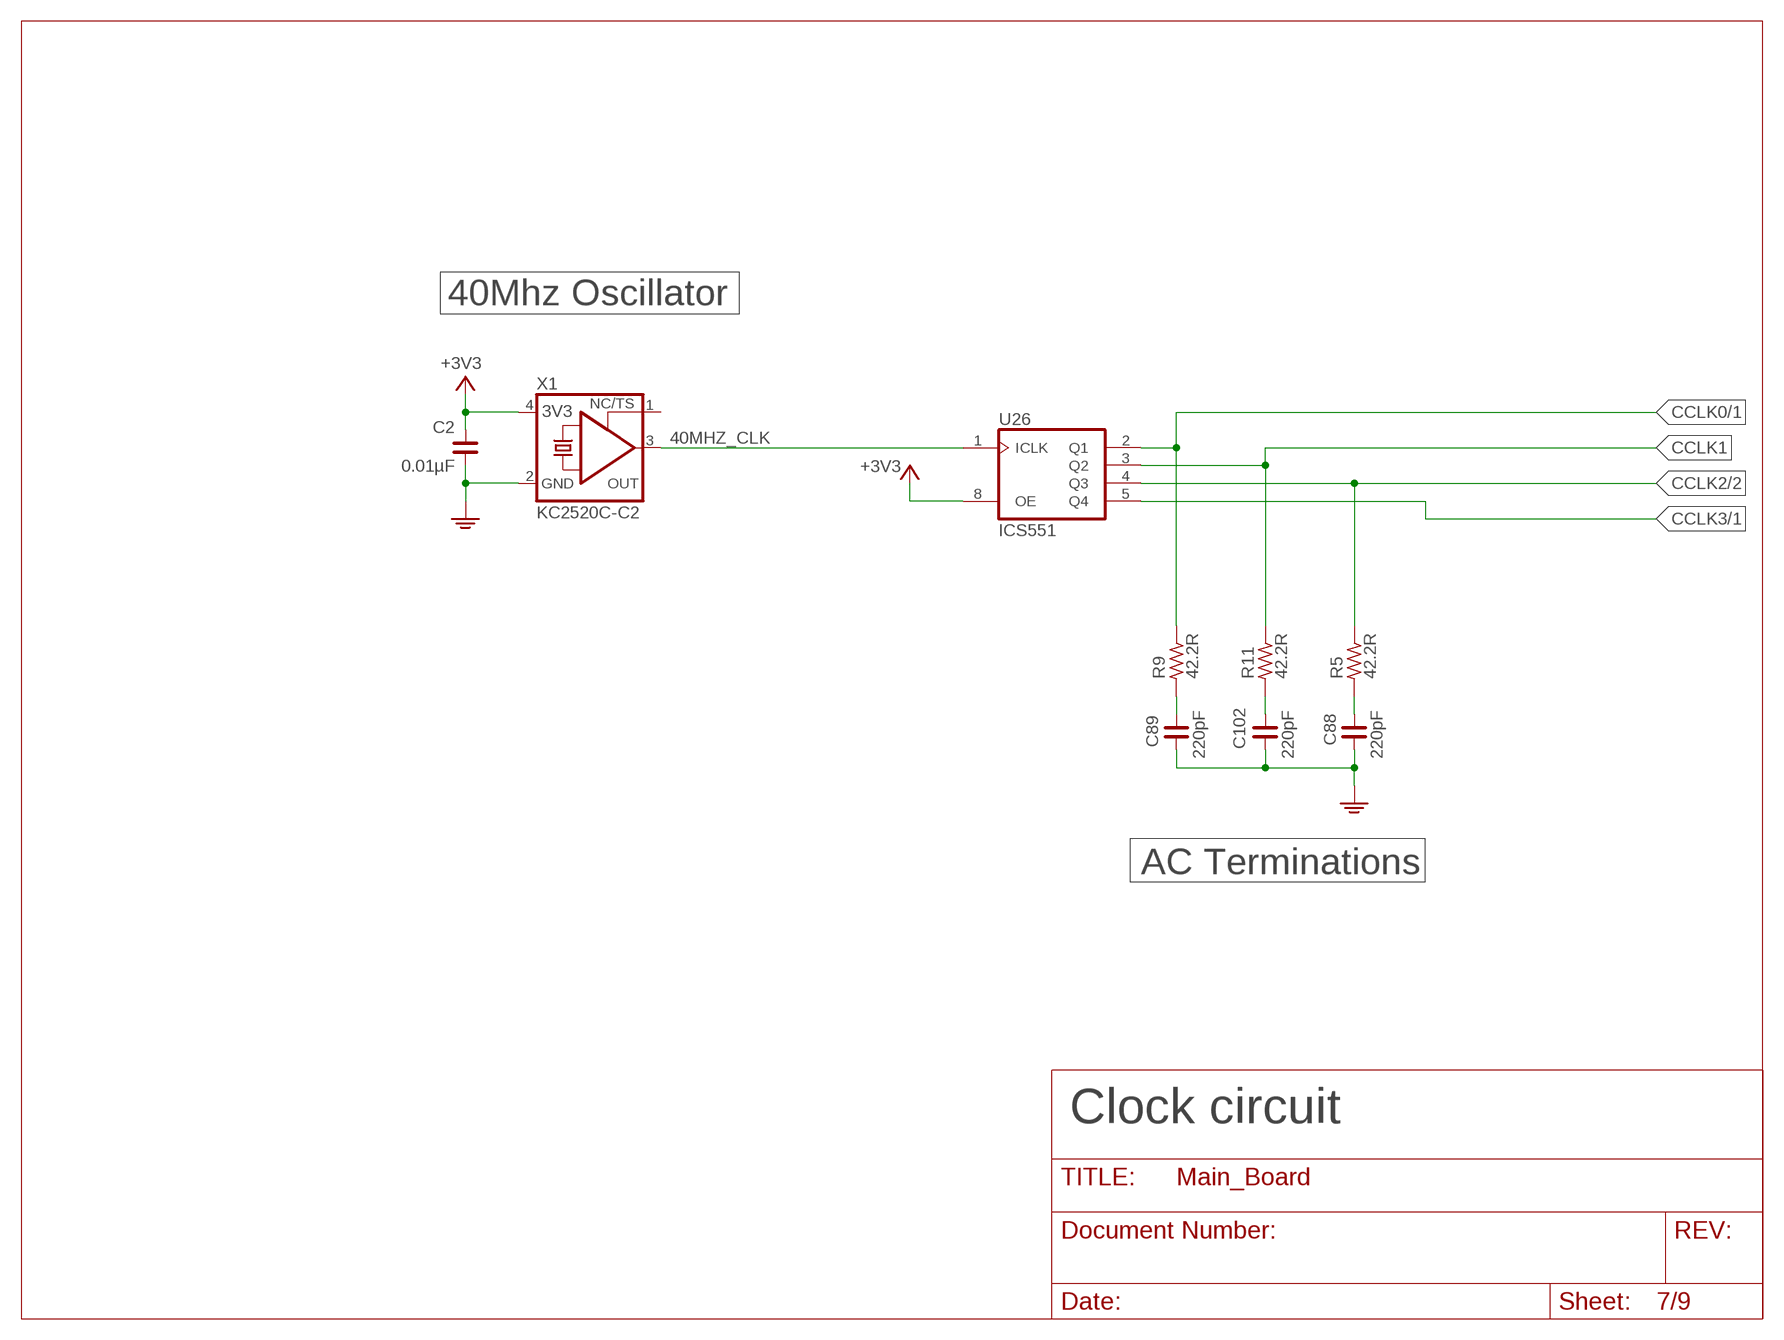
[diagram p6: schematic, sheet 7]

### Parts
C2  0.01µF  C_0603  [C0603]
C88  220pF  C_0603  [C0603]
C89  220pF  C_0603  [C0603]
C102  220pF  C_0603  [C0603]
R5  42.2R  R_0603  [R0603]
R9  42.2R  R_0603  [R0603]
R11  42.2R  R_0603  [R0603]
U26  ICS551  [SO08(SOT96)]
X1  KC2520C-C2  [OSCXO2.5X2.0]

### Nets
40MHZ_CLK: U26.1(ICLK) X1.3(OUT)
+3V3: C2.2 U26.8(OE) X1.4(+3V3) ; also sheet 1,2,3,4,5,8,9
CCLK0: R9.2 U26.2(Q1) ; also sheet 1
CCLK1: R11.2 U26.3(Q2) ; also sheet 6
CCLK2: R5.2 U26.4(Q3) ; also sheet 2
CCLK3: U26.5(Q4) ; also sheet 1
GND: C2.1 C88.1 C89.1 C102.1 X1.2(GND) ; also sheet 1,2,3,4,5,6,8
N$3: C88.2 R5.1
N$12: C89.2 R9.1
N$31: C102.2 R11.1
Unconnected: X1.1(TS)

### Notes on the sheet
- 40Mhz Oscillator
- AC Terminations
- Clock circuit

## Sheet 8 of 9: Decoupling capacitors & power
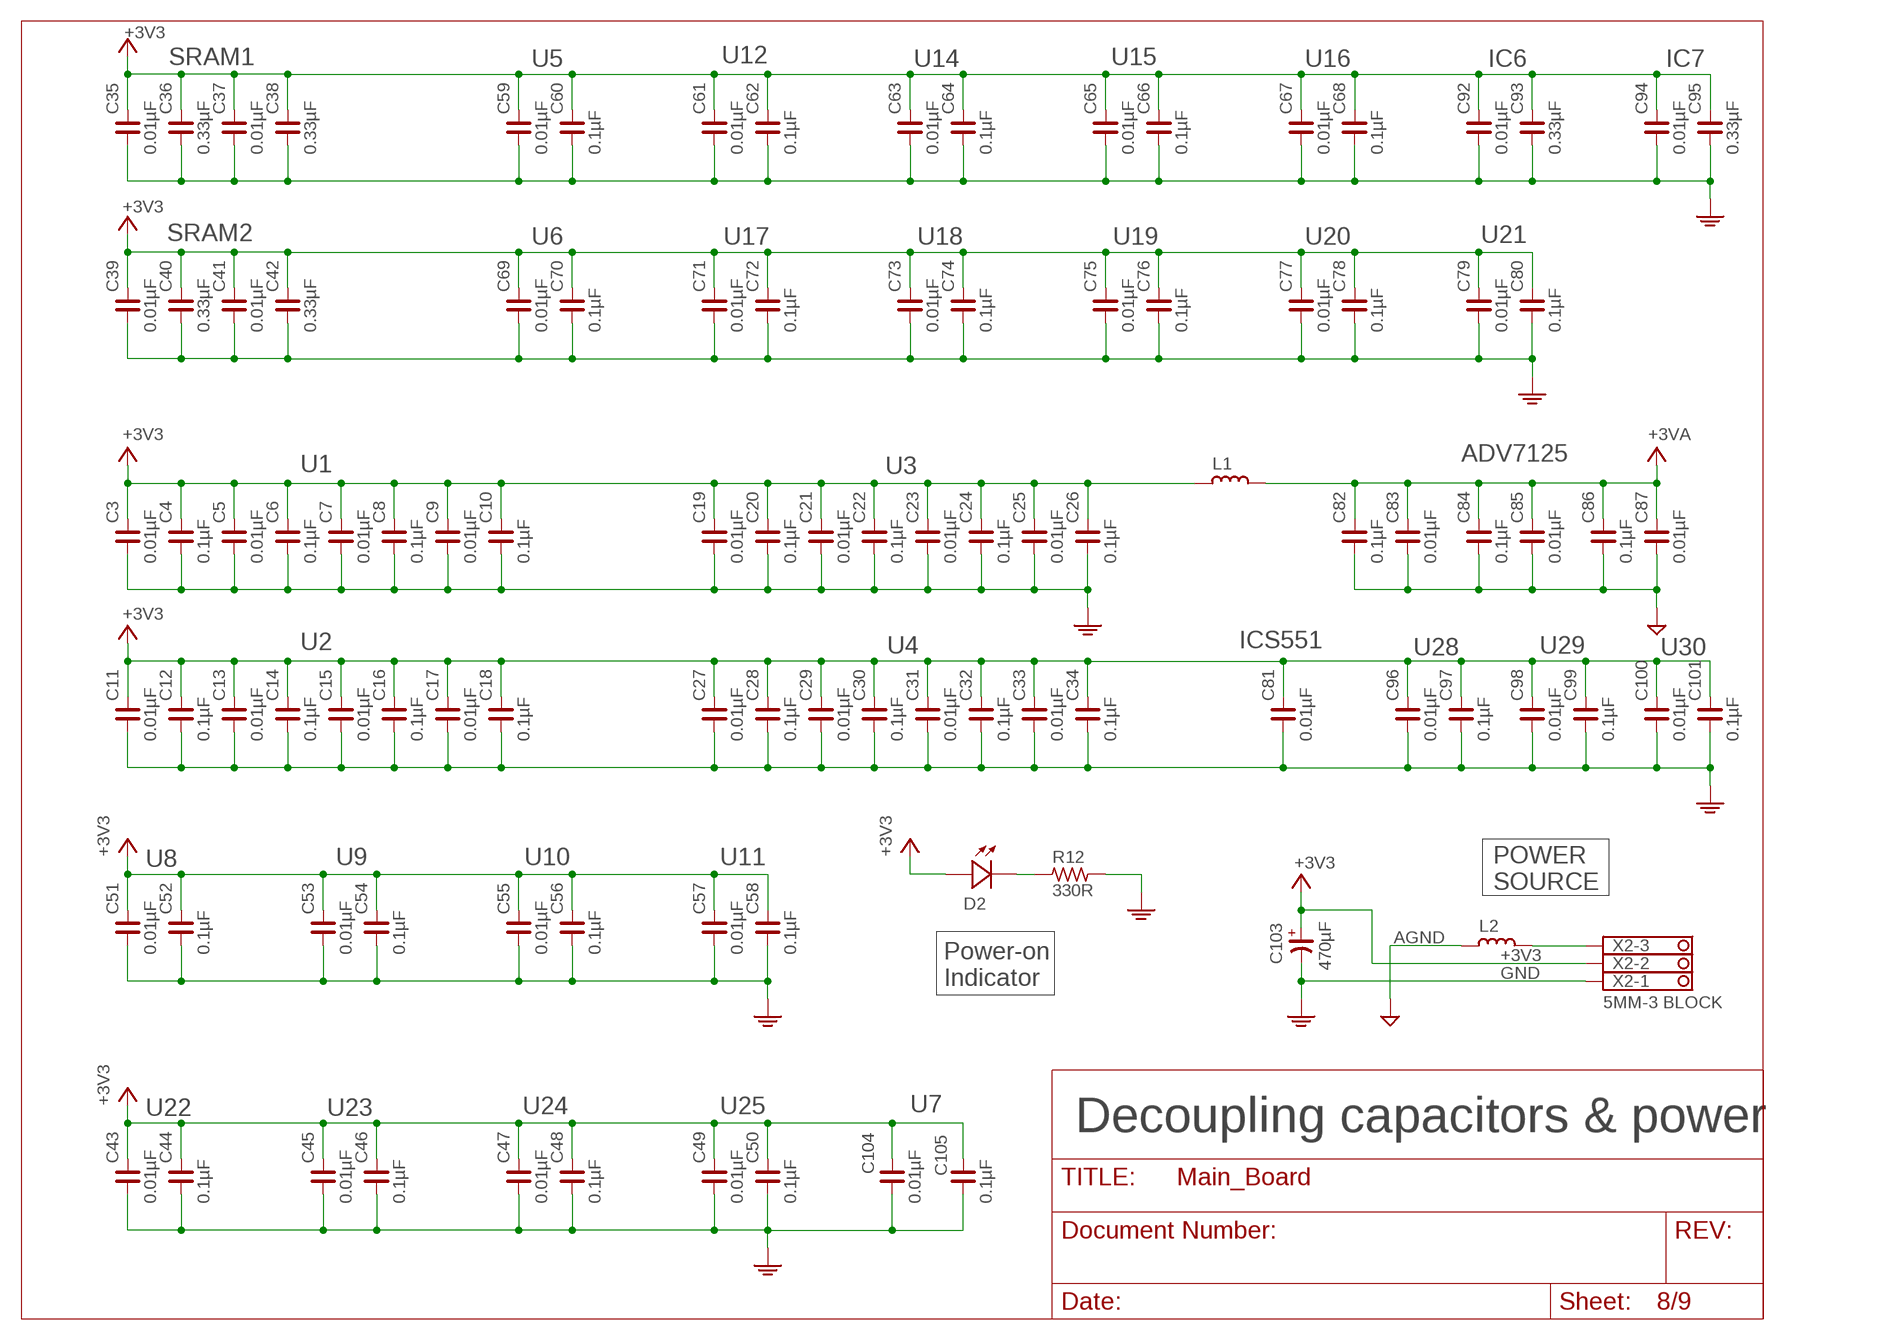
[diagram p7: schematic, sheet 8]

### Parts
C3  0.01µF  C_0603  [C0603]
C4  0.1µF  C_0603  [C0603]
C5  0.01µF  C_0603  [C0603]
C6  0.1µF  C_0603  [C0603]
C7  0.01µF  C_0603  [C0603]
C8  0.1µF  C_0603  [C0603]
C9  0.01µF  C_0603  [C0603]
C10  0.1µF  C_0603  [C0603]
C11  0.01µF  C_0603  [C0603]
C12  0.1µF  C_0603  [C0603]
C13  0.01µF  C_0603  [C0603]
C14  0.1µF  C_0603  [C0603]
C15  0.01µF  C_0603  [C0603]
C16  0.1µF  C_0603  [C0603]
C17  0.01µF  C_0603  [C0603]
C18  0.1µF  C_0603  [C0603]
C19  0.01µF  C_0603  [C0603]
C20  0.1µF  C_0603  [C0603]
C21  0.01µF  C_0603  [C0603]
C22  0.1µF  C_0603  [C0603]
C23  0.01µF  C_0603  [C0603]
C24  0.1µF  C_0603  [C0603]
C25  0.01µF  C_0603  [C0603]
C26  0.1µF  C_0603  [C0603]
C27  0.01µF  C_0603  [C0603]
C28  0.1µF  C_0603  [C0603]
C29  0.01µF  C_0603  [C0603]
C30  0.1µF  C_0603  [C0603]
C31  0.01µF  C_0603  [C0603]
C32  0.1µF  C_0603  [C0603]
C33  0.01µF  C_0603  [C0603]
C34  0.1µF  C_0603  [C0603]
C35  0.01µF  C_0603  [C0603]
C36  0.33µF  C_0603  [C0603]
C37  0.01µF  C_0603  [C0603]
C38  0.33µF  C_0603  [C0603]
C39  0.01µF  C_0603  [C0603]
C40  0.33µF  C_0603  [C0603]
C41  0.01µF  C_0603  [C0603]
C42  0.33µF  C_0603  [C0603]
C43  0.01µF  C_0603  [C0603]
C44  0.1µF  C_0603  [C0603]
C45  0.01µF  C_0603  [C0603]
C46  0.1µF  C_0603  [C0603]
C47  0.01µF  C_0603  [C0603]
C48  0.1µF  C_0603  [C0603]
C49  0.01µF  C_0603  [C0603]
C50  0.1µF  C_0603  [C0603]
C51  0.01µF  C_0603  [C0603]
C52  0.1µF  C_0603  [C0603]
C53  0.01µF  C_0603  [C0603]
C54  0.1µF  C_0603  [C0603]
C55  0.01µF  C_0603  [C0603]
C56  0.1µF  C_0603  [C0603]
C57  0.01µF  C_0603  [C0603]
C58  0.1µF  C_0603  [C0603]
C59  0.01µF  C_0603  [C0603]
C60  0.1µF  C_0603  [C0603]
C61  0.01µF  C_0603  [C0603]
C62  0.1µF  C_0603  [C0603]
C63  0.01µF  C_0603  [C0603]
C64  0.1µF  C_0603  [C0603]
C65  0.01µF  C_0603  [C0603]
C66  0.1µF  C_0603  [C0603]
C67  0.01µF  C_0603  [C0603]
C68  0.1µF  C_0603  [C0603]
C69  0.01µF  C_0603  [C0603]
C70  0.1µF  C_0603  [C0603]
C71  0.01µF  C_0603  [C0603]
C72  0.1µF  C_0603  [C0603]
C73  0.01µF  C_0603  [C0603]
C74  0.1µF  C_0603  [C0603]
C75  0.01µF  C_0603  [C0603]
C76  0.1µF  C_0603  [C0603]
C77  0.01µF  C_0603  [C0603]
C78  0.1µF  C_0603  [C0603]
C79  0.01µF  C_0603  [C0603]
C80  0.1µF  C_0603  [C0603]
C81  0.01µF  C_0603  [C0603]
C82  0.1µF  C_0603  [C0603]
C83  0.01µF  C_0603  [C0603]
C84  0.1µF  C_0603  [C0603]
C85  0.01µF  C_0603  [C0603]
C86  0.1µF  C_0603  [C0603]
C87  0.01µF  C_0603  [C0603]
C92  0.01µF  C_0603  [C0603]
C93  0.33µF  C_0603  [C0603]
C94  0.01µF  C_0603  [C0603]
C95  0.33µF  C_0603  [C0603]
C96  0.01µF  C_0603  [C0603]
C97  0.1µF  C_0603  [C0603]
C98  0.01µF  C_0603  [C0603]
C99  0.1µF  C_0603  [C0603]
C100  0.01µF  C_0603  [C0603]
C101  0.1µF  C_0603  [C0603]
C103  470µF  CP_SV-G  [CSV-G]
C104  0.01µF  C_0603  [C0603]
C105  0.1µF  C_0603  [C0603]
D2  DEL-1206  [DEL1206]
L1  L_0805  [L0805]
L2  L_0805  [L0805]
R12  330R  R_1206  [R1206]
X2  5MM-3 BLOCK  TERMINAL-BLOCK-5MM-3-PIN-LONG-PAD  [TERMINAL-BLOCK-3-PIN-5MM]

### Nets
+3V3: C3.2 C4.2 C5.2 C6.2 C7.2 C8.2 C9.2 C10.2 C11.2 C12.2 C13.2 C14.2 C15.2 C16.2 C17.2 C18.2 C19.2 C20.2 C21.2 C22.2 C23.2 C24.2 C25.2 C26.2 C27.2 C28.2 C29.2 C30.2 C31.2 C32.2 C33.2 C34.2 C35.2 C36.2 C37.2 C38.2 C39.2 C40.2 C41.2 C42.2 C43.2 C44.2 C45.2 C46.2 C47.2 C48.2 C49.2 C50.2 C51.2 C52.2 C53.2 C54.2 C55.2 C56.2 C57.2 C58.2 C59.2 C60.2 C61.2 C62.2 C63.2 C64.2 C65.2 C66.2 C67.2 C68.2 C69.2 C70.2 C71.2 C72.2 C73.2 C74.2 C75.2 C76.2 C77.2 C78.2 C79.2 C80.2 C81.2 C92.2 C93.2 C94.2 C95.2 C96.2 C97.2 C98.2 C99.2 C100.2 C101.2 C103.+ C104.2 C105.2 D2.A L1.2 X2.2 ; also sheet 1,2,3,4,5,7,9
+3VA: C82.2 C83.2 C84.2 C85.2 C86.2 C87.2 L1.1 ; also sheet 6
AGND: C82.1 C83.1 C84.1 C85.1 C86.1 C87.1 L2.2 ; also sheet 6
GND: C3.1 C4.1 C5.1 C6.1 C7.1 C8.1 C9.1 C10.1 C11.1 C12.1 C13.1 C14.1 C15.1 C16.1 C17.1 C18.1 C19.1 C20.1 C21.1 C22.1 C23.1 C24.1 C25.1 C26.1 C27.1 C28.1 C29.1 C30.1 C31.1 C32.1 C33.1 C34.1 C35.1 C36.1 C37.1 C38.1 C39.1 C40.1 C41.1 C42.1 C43.1 C44.1 C45.1 C46.1 C47.1 C48.1 C49.1 C50.1 C51.1 C52.1 C53.1 C54.1 C55.1 C56.1 C57.1 C58.1 C59.1 C60.1 C61.1 C62.1 C63.1 C64.1 C65.1 C66.1 C67.1 C68.1 C69.1 C70.1 C71.1 C72.1 C73.1 C74.1 C75.1 C76.1 C77.1 C78.1 C79.1 C80.1 C81.1 C92.1 C93.1 C94.1 C95.1 C96.1 C97.1 C98.1 C99.1 C100.1 C101.1 C103.- C104.1 C105.1 R12.2 X2.1 ; also sheet 1,2,3,4,5,6,7
N$28: D2.C R12.1
SUPPLY_REF: L2.1 X2.3

### Notes on the sheet
- SRAM1 | U5 | U12 | U14 | U15 | U16 | IC6 | IC7
- SRAM2 | U6 | U17 | U18 | U19 | U20 | U21
- ADV7125
- U1 | U3
- U2 | U4 | ICS551 | U28 | U29 | U30
- U8 | U9 | U10 | U11
- POWER
  SOURCE
- Power-on
  Indicator
- U22 | U23 | U24 | U25 | U7
- Decoupling capacitors & power

## Sheet 9 of 9: Unused gates
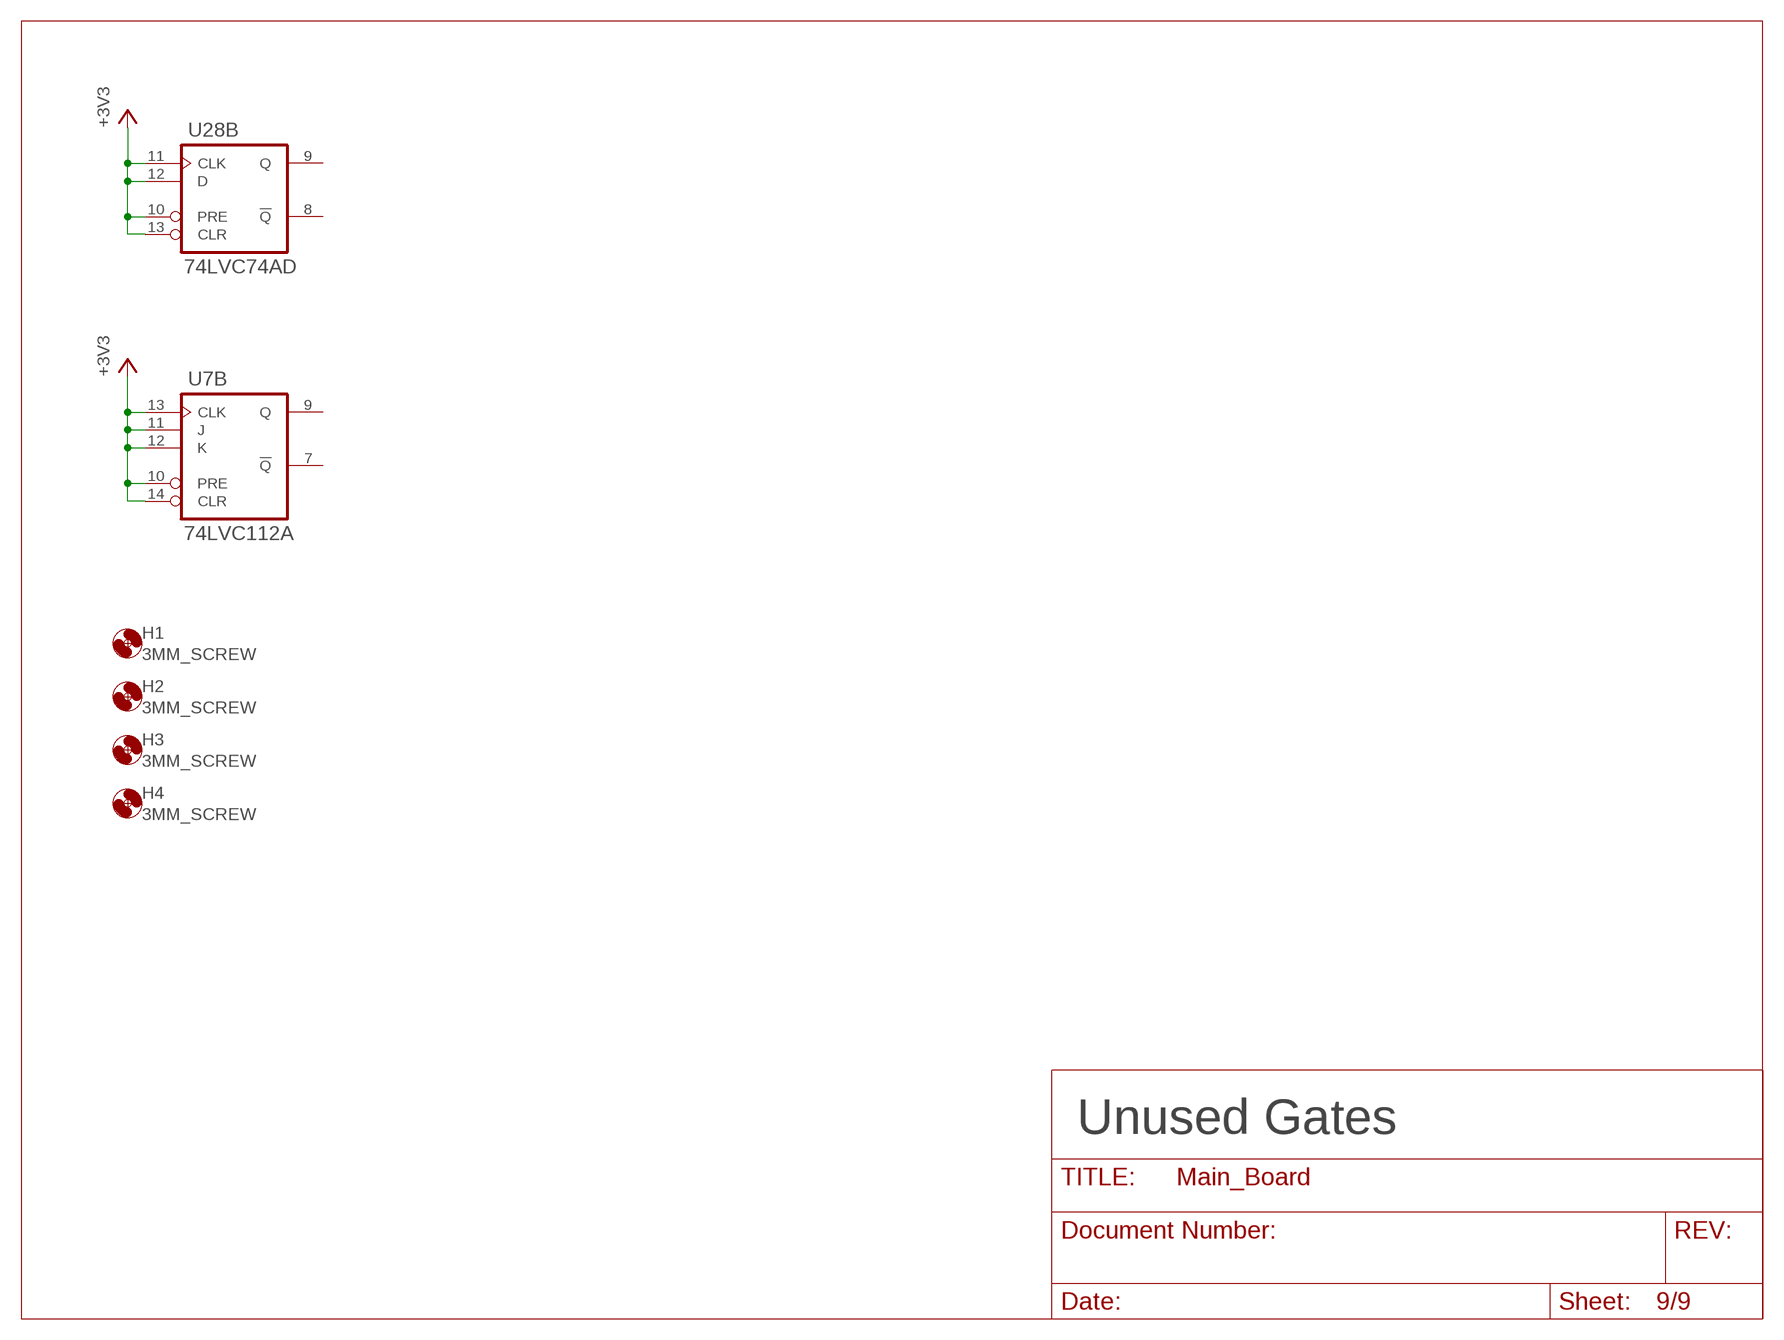
[diagram p8: schematic, sheet 9]

### Parts
H1  3MM_SCREW  SCREW_MOUNT_HOLE3.0  [3MM_HOLE]
H2  3MM_SCREW  SCREW_MOUNT_HOLE3.0  [3MM_HOLE]
H3  3MM_SCREW  SCREW_MOUNT_HOLE3.0  [3MM_HOLE]
H4  3MM_SCREW  SCREW_MOUNT_HOLE3.0  [3MM_HOLE]

### Nets
+3V3: U7.10(B:PRE) U7.11(B:J) U7.12(B:K) U7.13(B:CLK) U7.14(B:CLR) U28.10(B:PRE) U28.11(B:CLK) U28.12(B:D) U28.13(B:CLR) ; also sheet 1,2,3,4,5,7,8
Unconnected: U7.7(B:!Q) U7.9(B:Q) U28.8(B:!Q) U28.9(B:Q)

### Notes on the sheet
- Unused Gates

## Power pins joined to a net without a drawn wire
+3V3: IC6.24(+3V3) IC7.24(+3V3) U5.16(+3V3) U6.16(+3V3) U7.16(PWR:+3V3) U8.20(+3V3) U9.20(+3V3) U10.20(+3V3) U11.20(+3V3) U12.16(+3V3) U13.5(+3V3) U14.16(+3V3) U15.16(+3V3) U16.16(+3V3) U17.16(+3V3) U18.16(+3V3) U19.16(+3V3) U20.16(+3V3) U21.16(+3V3) U22.16(+3V3) U23.16(+3V3) U24.16(+3V3) U25.16(+3V3) U26.7(+3V3) U27.5(+3V3) U28.14(PWR:+3V3) U29.16(PWR:+3V3) U30.16(PWR:+3V3) U31.5(+3V3) U32.5(+3V3)
GND: IC6.12(GND) IC7.12(GND) U5.8(GND) U6.8(GND) U7.8(PWR:GND) U8.10(GND) U9.10(GND) U10.10(GND) U11.10(GND) U12.8(GND) U13.3(GND) U14.8(GND) U15.8(GND) U16.8(GND) U17.8(GND) U18.8(GND) U19.8(GND) U20.8(GND) U21.8(GND) U22.8(GND) U23.8(GND) U24.8(GND) U25.8(GND) U26.6(GND) U27.3(GND) U28.7(PWR:GND) U29.8(PWR:GND) U30.8(PWR:GND) U31.3(GND) U32.3(GND)

## Library data of the parts
ADV7125 = xavier:ADV7125: triple 8-bit 3.3V high speed video DAC
C1-C46 C48-C102 C104 C105 = xavier:C_: NON-POLARIZED CAP
C47 = xavier:C_: NON-POLARIZED CAP; SPICEPREFIX: C
C103 = xavier:CP_: POLARIZED CAP
D1 = xavier:AD1580: 1.2 V Micropower, Precision 1.2 V Micropower, Precision; MPN: AD1580BRTZ; OC_FARNELL: 1660953; OC_NEWARK: 45P6048; PACKAGE: SOT-23-3; SUPPLIER: Analog Devices
D2 = xavier:DEL: Diode émettrice de lumière
H1-H4 = xavier:SCREW_MOUNT_HOLE: MOUNTING HOLE with drill center marker
IC6 IC7 = xavier:PALLV22V10: 3.3V variant of PAL22V10 device
J1 = xavier:VGA-DB15: DB-15 connector for VGA, 90 degrees
L1 L2 = xavier:L_: INDUCTOR
LPC1769 = xavier:LPCXPRESSO_LPC1769
R1-R5 R8-R12 = xavier:R_: RESISTOR
SRAM1 SRAM2 = xavier:CY7C1059DV33: 1M x 8bit Asynchronous SRAM
U1-U4 = xavier:74ALVCH16827DL: 20-bit buffer/driver with 3-state outputs
U5 U6 U12 U14-U21 = xavier:74LVC163: 4-bit synchronous counter with RCO output
U7 = xavier:74LVC112A: Dual JK Latch, negative edge triggered
U8-U11 = xavier:74LVC245A: Octal bus transceiver with 3-state outputs
U13 = xavier:74LVC1G02: Single NOR gate
U22-U25 = xavier:74LVC595A: 8-bit serial-in/serial-out or parallel-out shift register with 3-state ouput
U26 = xavier:ICS551: Clock fanout buffer 1 to 4, 160MHz with 3-state outputs
U27 U31 = xavier:74LVC1G00: Single NOR gate
U28 = xavier:74LVC74AD: Dual D Latch, positive edge triggered
U29 U30 = xavier:74LVC109A: Dual JK Latch, positive edge triggered
U32 = xavier:74AHC1G02DCK: Single NOR gate
X1 = xavier:KC2520C-C2: SMD crystal oscillator
X2 = xavier:TERMINAL-BLOCK-5MM-3-PIN: Terminal Block 3.5mm Pitch: 3,5 mm Number of pins: 3 Created by Rembrandt Electronics www.rembrandtelectronics.com